# Altium project zxRevo rev2.5.PrjPcb (part 2 of 3)

## Sheet Power ATX.SchDoc
size A3; SheetNumber: 2; SheetTotal: 16
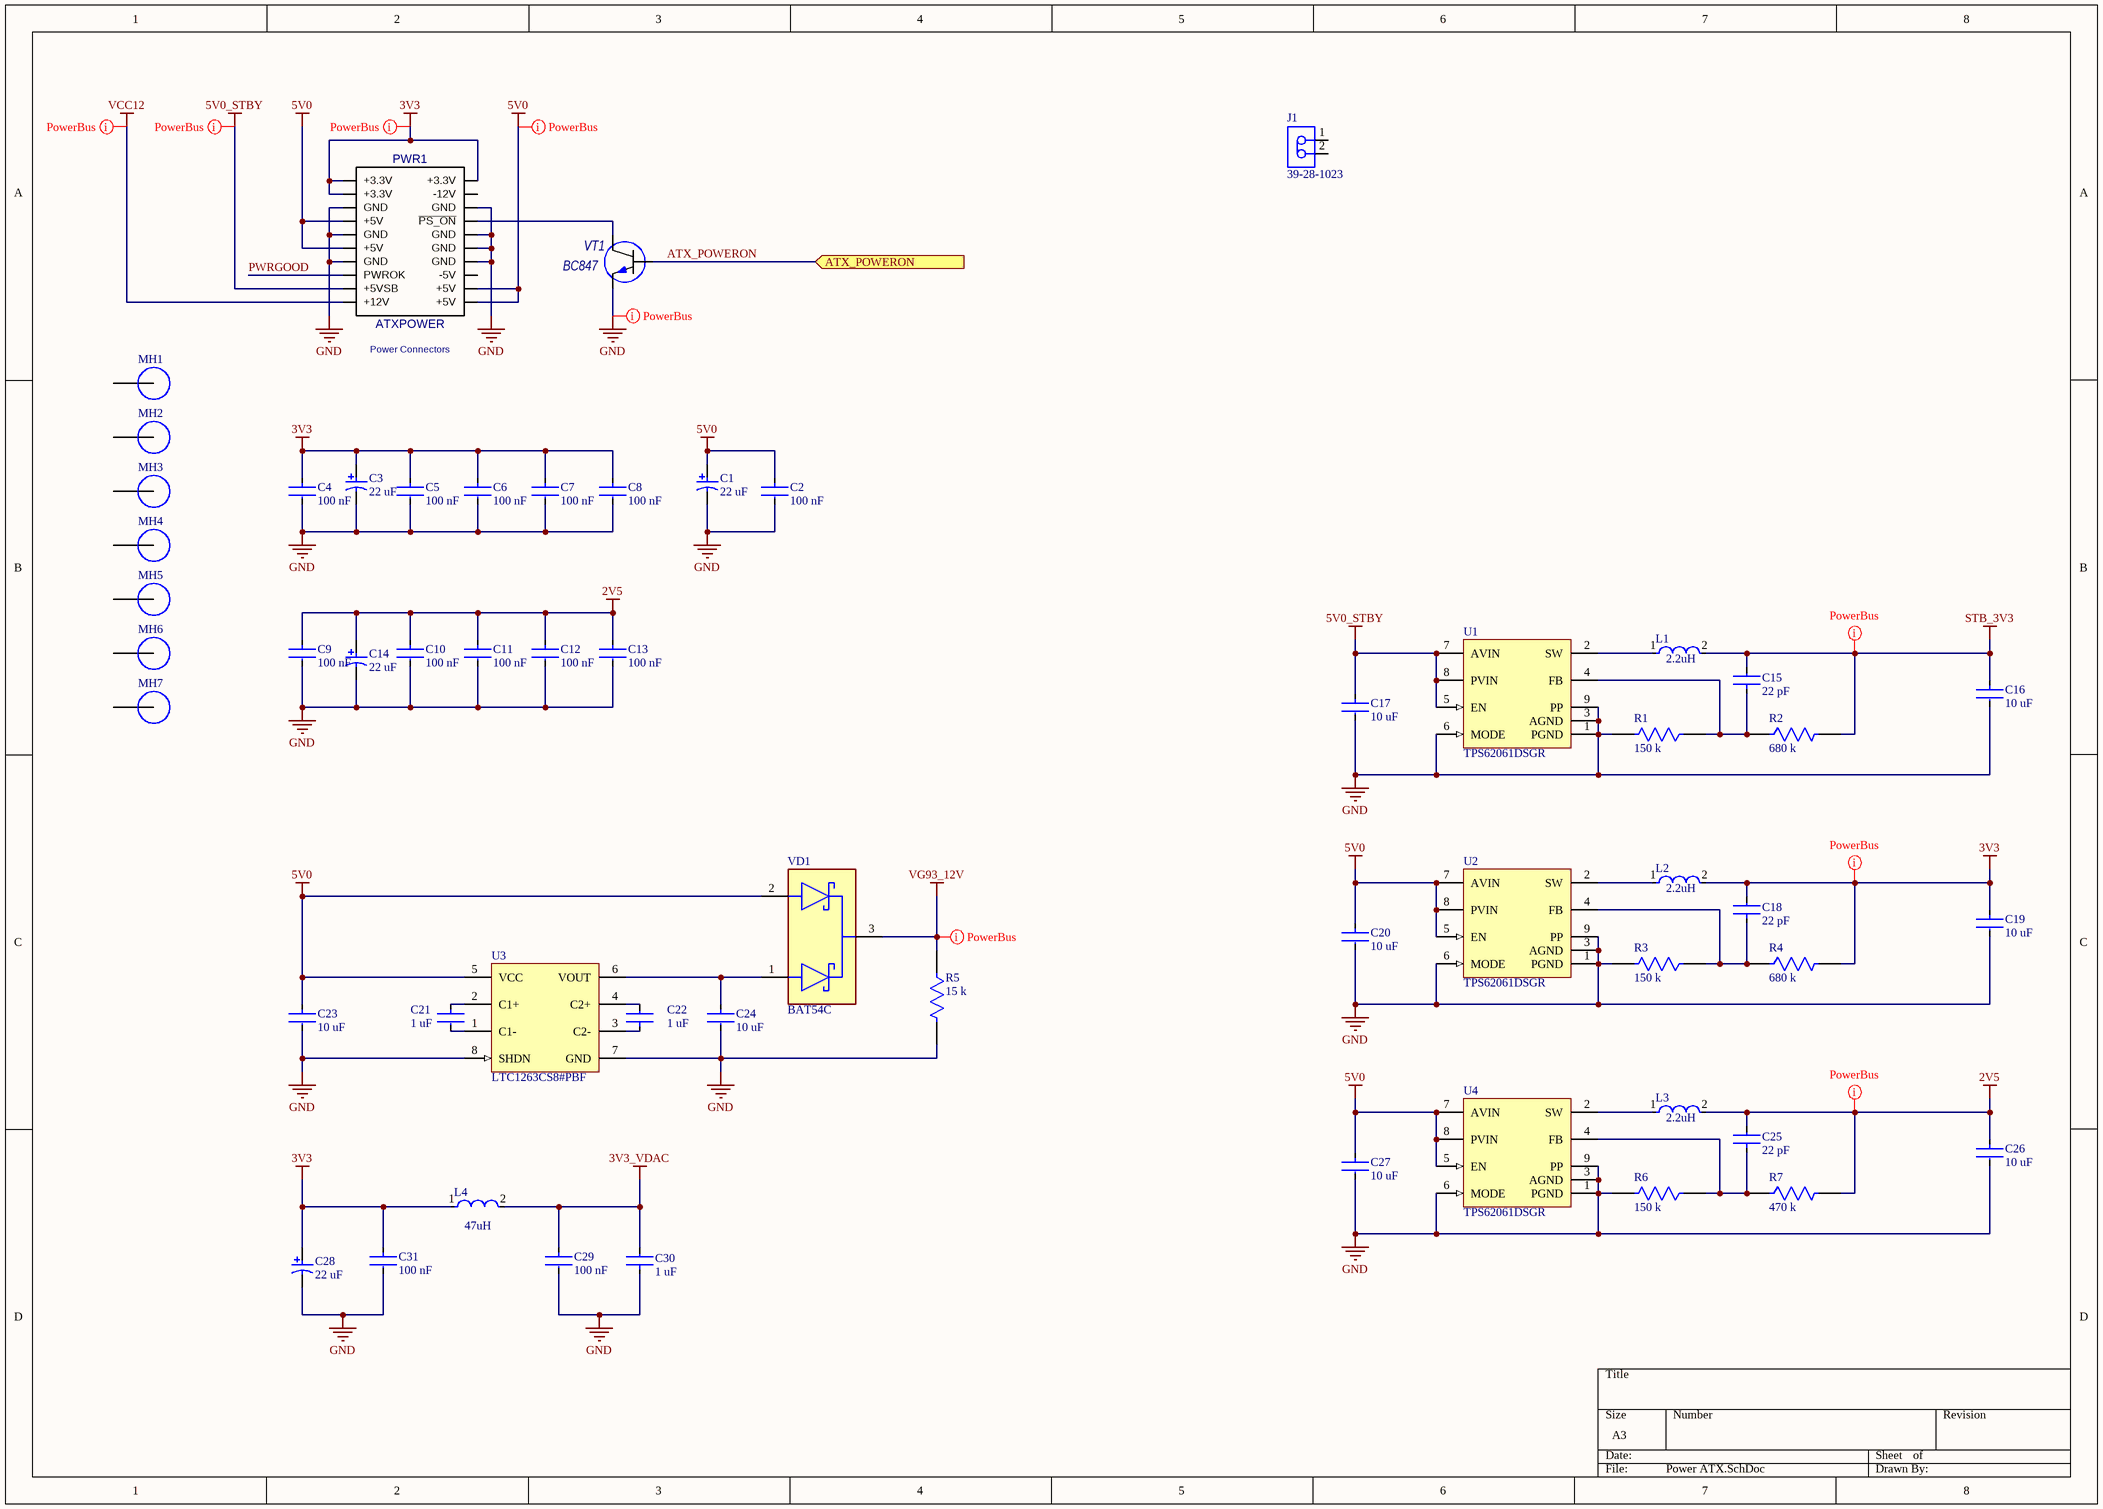
[diagram p9: Power ATX.SchDoc]

### Parts
C1  Capacitance: 22 uF  [AVX-TAJ-B-2_M]  (hidden comment: EC1210-22uF)
C2  Capacitance: 100 nF  [CC0805]  (hidden comment: CC0805-1.5pF)
C3  Capacitance: 22 uF  [AVX-TAJ-B-2_M]  (hidden comment: EC1210-22uF)
C4  Capacitance: 100 nF  [CC0805]  (hidden comment: CC0805-1.5pF)
C5  Capacitance: 100 nF  [CC0805]  (hidden comment: CC0805-1.5pF)
C6  Capacitance: 100 nF  [CC0805]  (hidden comment: CC0805-1.5pF)
C7  Capacitance: 100 nF  [CC0805]  (hidden comment: CC0805-1.5pF)
C8  Capacitance: 100 nF  [CC0805]  (hidden comment: CC0805-1.5pF)
C9  Capacitance: 100 nF  [CC0805]  (hidden comment: CC0805-1.5pF)
C10  Capacitance: 100 nF  [CC0805]  (hidden comment: CC0805-1.5pF)
C11  Capacitance: 100 nF  [CC0805]  (hidden comment: CC0805-1.5pF)
C12  Capacitance: 100 nF  [CC0805]  (hidden comment: CC0805-1.5pF)
C13  Capacitance: 100 nF  [CC0805]  (hidden comment: CC0805-1.5pF)
C14  Capacitance: 22 uF  [AVX-TAJ-B-2_M]  (hidden comment: EC1210-22uF)
C15  Capacitance: 22 pF  [CC0805]  (hidden comment: CC0805-1.5pF)
C16  Capacitance: 10 uF  [CC0805]  (hidden comment: CC0805-1.5pF)
C17  Capacitance: 10 uF  [CC0805]  (hidden comment: CC0805-1.5pF)
C18  Capacitance: 22 pF  [CC0805]  (hidden comment: CC0805-1.5pF)
C19  Capacitance: 10 uF  [CC0805]  (hidden comment: CC0805-1.5pF)
C20  Capacitance: 10 uF  [CC0805]  (hidden comment: CC0805-1.5pF)
C21  Capacitance: 1 uF  [CC0805]  (hidden comment: CC0805-1.5pF)
C22  Capacitance: 1 uF  [CC0805]  (hidden comment: CC0805-1.5pF)
C23  Capacitance: 10 uF  [CC0805]  (hidden comment: CC0805-1.5pF)
C24  Capacitance: 10 uF  [CC0805]  (hidden comment: CC0805-1.5pF)
C25  Capacitance: 22 pF  [CC0805]  (hidden comment: CC0805-1.5pF)
C26  Capacitance: 10 uF  [CC0805]  (hidden comment: CC0805-1.5pF)
C27  Capacitance: 10 uF  [CC0805]  (hidden comment: CC0805-1.5pF)
C28  Capacitance: 22 uF  [AVX-TAJ-B-2_M]  (hidden comment: EC1210-22uF)
C29  Capacitance: 100 nF  [CC0805]  (hidden comment: CC0805-1.5pF)
C30  Capacitance: 1 uF  [CC0805]  (hidden comment: CC0805-1.5pF)
C31  Capacitance: 100 nF  [CC0805]  (hidden comment: CC0805-1.5pF)
J1  39-28-1023  [MOLX-39-28-1023-2_V]
L1  Inductance: 2.2uH  [FP-NR6028-MFG]  (hidden comment: NR6028T2R2N)
L2  Inductance: 2.2uH  [FP-NR6028-MFG]  (hidden comment: NR6028T2R2N)
L3  Inductance: 2.2uH  [FP-NR6028-MFG]  (hidden comment: NR6028T2R2N)
L4  Inductance: 47uH  [FP-NR6028-MFG]  (hidden comment: NR6028T470M)
MH1  MOUNT HOLE  [MOUNT HOLE]  (value not drawn)
MH2  MOUNT HOLE  [MOUNT HOLE]  (value not drawn)
MH3  MOUNT HOLE  [MOUNT HOLE]  (value not drawn)
MH4  MOUNT HOLE  [MOUNT HOLE]  (value not drawn)
MH5  MOUNT HOLE  [MOUNT HOLE]  (value not drawn)
MH6  MOUNT HOLE  [MOUNT HOLE]  (value not drawn)
MH7  MOUNT HOLE  [MOUNT HOLE]  (value not drawn)
PWR1  ATXPOWER  [ATXPOWER]
R1  Resistance: 150 k  [CR0805]  (hidden comment: CR0805-51)
R2  Resistance: 680 k  [CR0805]  (hidden comment: CR0805-51)
R3  Resistance: 150 k  [CR0805]  (hidden comment: CR0805-51)
R4  Resistance: 680 k  [CR0805]  (hidden comment: CR0805-51)
R5  Resistance: 15 k  [CR0805]  (hidden comment: CR0805-51)
R6  Resistance: 150 k  [CR0805]  (hidden comment: CR0805-51)
R7  Resistance: 470 k  [CR0805]  (hidden comment: CR0805-51)
U1  TPS62061DSGR  [DSG0008A_V]
U2  TPS62061DSGR  [DSG0008A_V]
U3  LTC1263CS8#PBF  [LT-S8-8_N]
U4  TPS62061DSGR  [DSG0008A_V]
VD1  BAT54C  [SOT-23]
VT1  BC847  [SOT-23]

### Ports
ATX_POWERON (in)

### Nets
2V5: C9.1 C10.1 C11.1 C12.1 C13.1 C14.1 C25.2 C26.1 L3.2 R7.2
3V3: C3.1 C4.1 C5.1 C6.1 C7.1 C8.1 C18.2 C19.1 C28.1 C31.1 L2.2 L4.1 PWR1.1(+3.3V) PWR1.2(+3.3V) PWR1.11(+3.3V) R4.2
3V3_VDAC: C29.1 C30.2 L4.2
5V0: C1.1 C2.1 C20.1 C23.1 C27.1 PWR1.4(+5V) PWR1.6(+5V) PWR1.19(+5V) PWR1.20(+5V) U2.5(EN) U2.7(AVIN) U2.8(PVIN) U3.5(VCC) U4.5(EN) U4.7(AVIN) U4.8(PVIN) VD1.2(2_ANODE)
5V0_STBY: C17.1 PWR1.9(+5VSB) U1.5(EN) U1.7(AVIN) U1.8(PVIN)
GND: C1.2 C2.2 C3.2 C4.2 C5.2 C6.2 C7.2 C8.2 C9.2 C10.2 C11.2 C12.2 C13.2 C14.2 C16.2 C17.2 C19.2 C20.2 C23.2 C24.2 C26.2 C27.2 C28.2 C29.2 C30.1 C31.2 PWR1.3(GND) PWR1.5(GND) PWR1.7(GND) PWR1.13(GND) PWR1.15(GND) PWR1.16(GND) PWR1.17(GND) R1.2 R3.2 R5.2 R6.2 U1.1(PGND) U1.3(AGND) U1.6(MODE) U1.9(PP) U2.1(PGND) U2.3(AGND) U2.6(MODE) U2.9(PP) U3.7(GND) U3.8(SHDN) U4.1(PGND) U4.3(AGND) U4.6(MODE) U4.9(PP) VT1.2(emitter)
STB_3V3: C15.2 C16.1 L1.2 R2.2
VCC12: PWR1.10(+12V)
VG93_12V: R5.1 VD1.3(COMMON_CATHODE)
ATX_POWERON: VT1.1(base) ; port ATX_POWERON
PWRGOOD: PWR1.8(PWROK)  [project net PWRGOOD_2]
NetC15_1: C15.1 R1.1 R2.1 U1.4(FB)
NetC18_1: C18.1 R3.1 R4.1 U2.4(FB)
NetC21_1: C21.1 U3.2(C1+)
NetC21_2: C21.2 U3.1(C1-)
NetC22_1: C22.1 U3.3(C2-)
NetC22_2: C22.2 U3.4(C2+)
NetC24_1: C24.1 U3.6(VOUT) VD1.1(1_ANODE)
NetC25_1: C25.1 R6.1 R7.1 U4.4(FB)
NetL1_1: L1.1 U1.2(SW)
NetL2_1: L2.1 U2.2(SW)
NetL3_1: L3.1 U4.2(SW)
NetPWR1_14: PWR1.14(~{PS_ON}) VT1.3(collector)

Not connected (* = marked no-connect by the designer): J1 1 2; MH1 0(55); MH2 0(55); MH3 0(55); MH4 0(55); MH5 0(55); MH6 0(55); MH7 0(55); PWR1 12(-12V) 18(-5V)

### Layout directives
net class PowerBus: 2V5, 3V3, 5V0, 5V0_STBY, GND, STB_3V3, VCC12, VG93_12V

### Notes on the sheet
- (near PWR1) Power Connectors

### Library data of the parts
C1 C3 C14 C28 = EC1210-22uF: Standard Tantalum, 22 uF, +/- 10%, 16 V, -55 to 125 degC, 2-Pin SMD (1210), RoHS, Tape and Reel; Manufacturer: Kyocera AVX; Manufacturer Part Number: TAJB226K016RNJ; value: 22uF; Number of Pins: 2; Termination: SMD/SMT; Case/Package: 1210; Category: Cap
C2 C4-C13 C15-C20 C23-C27 C29 C31 = CC0805: as C33 on sheet TOP; value: 1.5pF; Category: Cap; Case/Package: 0805
C21 C22 C30 = CC0805: CL21 Series 0805 1.5pF 50V ±0.25pF Tolerance C0G Multilayer Ceramic Chip Capacitor; Manufacturer: Samsung; Manufacturer Part Number: CL21C1R5CBANNNC; Case/Package: 0805; value: 1.5pF; Category: Cap
J1 = CMP-2000-05244-1: Female Header, Pitch 4.2 mm, 1 x 2 Position, Height 12.8 mm, Tail Length 3.5 mm, -40 to 105 degC, RoHS; Manufacturer: Molex; No. of Poles: 2; Working Voltage: 250V; No. of Rows: 1; Current Rating: 13A; Contact Termination: Solder; No. of Contacts: 4; Connector Body Material: –; Voltage Rating V AC: 600V; Mounting Orientation: Straight; Pitch Spacing: 4.2mm; Connector Mounting: PCB; Connector Type: RectangularPower; Manufacturer URL: http://www.molex.com/; Contact Plating: Tin; Gender: Header; Lead Spacing: 4.2mm; Colour: Clear; Series: Mini-FitJr; No. of Ways: 2; MSL: –; Connector Insert Type: Header; Flammability Rating: UL94V-2; Datasheet URL: https://datasheet.ciiva.com/11746/0900766b80460d9e-11746456.pdf; Termination Method: Solder; Mounting Type: PCBoard; Contact Material: Brass; Datasheet Version: Rev. F, 05/2004; SVHC: –; Connector Mounting Orientation: PCB; Contact Gender: –
L1-L3 = CMP-14484-000415-1: SMD Power Inductors 2.2uH ±30% 3.7A 26mΩ; Core Material: Ferrite; Test Frequency: 100kHz; DC Resistance (DCR): 26mR; Saturation Current: 4.2A; Self Resonant Frequency: 68MHz; Shielding: Shielded; Width: 0.236inch; Package Quantity: 2000; Case/Package: 2424; Length: 0.236inch; Height: 2.8mm; Height - Seated (Max): 0.11inch; RMS Current (Irms): 3.7A; Current Rating: 3.7A; Termination: SMD/SMT; Tolerance: 30%; Inductance Tolerance: 30%; Depth: 6.2mm; Halogen Free: Halogen Free; Mount: Surface Mount; Series: NR; Max DC Current: 3.7A; Number of Pins: 2; Min Operating Temperature: -25°C; Max Operating Temperature: 120°C; Packaging: Tape and Reel; Radiation Hardening: No; RoHS Compliant: Yes; Resistor Type: Wirewound
L4 = CMP-14484-001222-1: as L9 on sheet SDCARD; Termination: SMD/SMT; Package Quantity: 2000; RoHS Compliant: Yes; Halogen Free: Halogen Free; Length: 0.236inch; Series: NR; Tolerance: 20%; Width: 0.236inch; Height - Seated (Max): 0.11inch; Number of Pins: 2; Mount: Surface Mount; Min Operating Temperature: -25°C; RMS Current (Irms): 920mA; Packaging: Tape and Reel; Resistor Type: Wirewound; Case/Package: 2424; Inductance Tolerance: 20%; Max Operating Temperature: 120°C; Max DC Current: 920mA; Height: 2.8mm
PWR1 = ATXPOWER: Analogs: MF-20MA;N42GP-20; Value: ATXPOWER; Case/Package: Mini-Fit 20 PIN 5.2; Category: Connector
R1-R7 = CR0805: 51Ω ±0.5% 0.1W 1/10W Chip Resistor 0805 (2012 Metric) Thin Film; Manufacturer Part Number: RR1220Q-510-D; Manufacturer: Susumu; Category: Res; value: 51Ω; Case/Package: 0805; Number of Terminations: 2; Termination: SMD/SMT; Number of Pins: 2
U1 U2 U4 = CMP-0323-00325-3: Buck Step Down Regulator with 2.7 to 6 V Input and 1.8 V Output, -40 to 85 degC, 8-Pin WSON (DSG), Green (RoHS & no Sb/Br); Manufacturer: Texas Instruments; SubFamily: Step-Down Regulator; Vin(Max)(V): 6; Preset Vout(V): 1.8; Synchronous Rectification: TRUE; Iout(Max)(A): 1.6; Switch Current Limit(Typ)(A): 2.25; Iq(Typ)(mA): 0.018; Regulated Outputs(#): 1; Duty Cycle(Max)(%): 100; Rating: Catalog; Vin(Min)(V): 2.7; ComponentLink2Description: Package Specification; PartNumber: TPS62061DSGR; ComponentLink2URL: http://www.ti.com/litv/pdf/mpds308a; ComponentLink1Description: Datasheet; PackageDescription: 8-Pin Plastic Small Outline No-Lead, 2 x 2 x 0.8 mm Body, 0.5 mm Pitch, Exposed Pad; Code_JEDEC: MO-229; Mounting Technology: Surface Mount; Vout(Min)(V): 1.8; DatasheetVersion: SLVSA95A; ComponentLink3Description: URL Link1; ComponentLink1URL: http://www.ti.com/general/docs/lit/getliterature.tsp?genericPartNumber=TPS62061&fileType=pdf; PackageReference: DSG0008A; ComponentLink3URL: Samples URL:http://www.ti.com/product/tps62061#samples; PackageVersion: revB, Oct-2010; Topology: Buck; Vout(Max)(V): 1.8; Eco-Plan: Green (RoHS & no Sb/Br)
U3 = CMP-0475-00531-1: 60 mA Flash Memory Programming Supply, 4.75 to 5.5 V Vin, 12 V Vout, 8-pin SOIC (S8-8), 0 to 70 degC, Pb-Free; Manufacturer: Linear Technology; Isupply(mA): 0.3; Vin Min(V): 4.75; Vin Max(V): 5.5; Max Iout(mA): 60; Ishutdown(uA): 0.5; Voutput: 12V; Frequency(kHz): 300; ComponentLink3Description: Package Specification; ComponentLink1Description: Manufacturer URL; ComponentLink2URL: http://cds.linear.com/docs/en/datasheet/1263f.pdf; ComponentLink3URL: http://cds.linear.com/docs/en/packaging/05081610_G_SO8.pdf; PartNumber: LTC1263CS8#PBF; ComponentLink2Description: Datasheet; ComponentLink1URL: http://www.linear.com/; PackageVersion: Rev. G, 03/2012; RoHS: TRUE; PackageReference: S8-8; Mounting Technology: Surface Mount; PackageDescription: 8-Pin Plastic Small Outline (Narrow .150 Inch), Body 4.9 x 3.9 mm, Pitch 1.27 mm
VD1 = BAT54C: DIODE ARRAY SCHOTTKY 30V SOT23-3; Manufacturer: ON Semiconductor / Fairchild; Capacitance: 10pF; Category: Diode; Manufacturer Part Number: BAT54C; Value: BAT54C; Case/Package: SOT-23
VT1 = BC847: Value: BC847; Case/Package: SOT-23; Category: Transistor

## Sheet USB.SchDoc
size A4; SheetNumber: 7; SheetTotal: 15
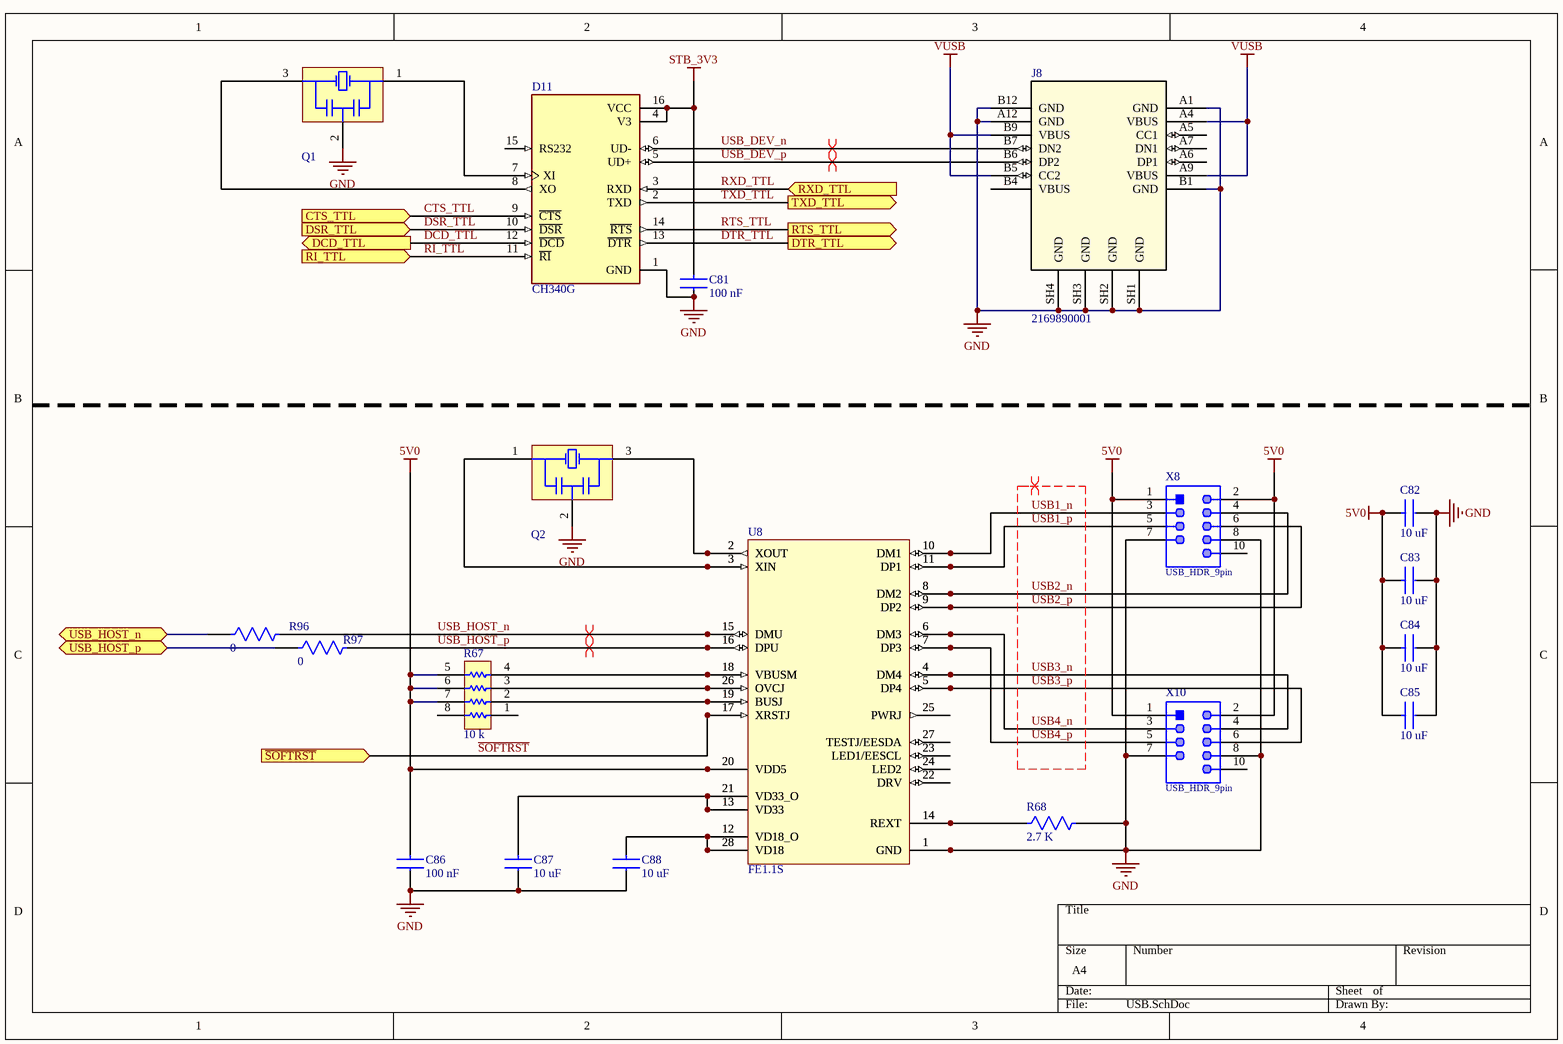
[diagram p10: USB.SchDoc]

### Parts
C81  Capacitance: 100 nF  [CC0805]  (hidden comment: CC0805-1.5pF)
C82  Capacitance: 10 uF  [CC0805]  (hidden comment: CC0805-1.5pF)
C83  Capacitance: 10 uF  [CC0805]  (hidden comment: CC0805-1.5pF)
C84  Capacitance: 10 uF  [CC0805]  (hidden comment: CC0805-1.5pF)
C85  Capacitance: 10 uF  [CC0805]  (hidden comment: CC0805-1.5pF)
C86  Capacitance: 100 nF  [CC0805]  (hidden comment: CC0805-1.5pF)
C87  Capacitance: 10 uF  [CC0805]  (hidden comment: CC0805-1.5pF)
C88  Capacitance: 10 uF  [CC0805]  (hidden comment: CC0805-1.5pF)
D11  CH340G  [SO16]
J8  2169890001  [216989-0001_MOL]
Q1  QTAL-12MHz  [MURA-CSTCE_G_V]  (value not drawn)
Q2  QTAL-12MHz  [MURA-CSTCE_G_V]  (value not drawn)
R67  Resistance: 10 k  [BOUR-CAY16-J4_V]  (hidden comment: CAY16-103J4LF)
R68  Resistance: 2.7 K  [CR0805]  (hidden comment: CR0805-51)
R96  Resistance: 0  [CR0805]  (hidden comment: CR0805-51)
R97  Resistance: 0  [CR0805]  (hidden comment: CR0805-51)
U8  FE1.1S  [TSOP64P600X160-28L]
X8  USB_HDR_9pin  [USB HDR 9 pin]
X10  USB_HDR_9pin  [USB HDR 9 pin]

### Ports
CTS_TTL (in), DCD_TTL (out), DSR_TTL (in), DTR_TTL (out), RI_TTL (in), RTS_TTL (out), RXD_TTL (in), TXD_TTL (out), USB_HOST_n (bidir), USB_HOST_p (bidir), ~{SOFTRST} (in)

### Nets
5V0: C82.1 C83.1 C84.1 C85.1 C86.1 R67.5 R67.6 R67.7 U8.20(VDD5) X8.1 X8.2 X10.1 X10.2
GND: C81.2 C82.2 C83.2 C84.2 C85.2 C86.2 C87.2 C88.2 D11.1(GND) J8.A1(GND) J8.A12(GND) J8.B1(GND) J8.B12(GND) J8.SH1(GND) J8.SH2(GND) J8.SH3(GND) J8.SH4(GND) Q1.2(GND) Q2.2(GND) R68.2 U8.1(GND) X8.7 X8.8 X10.7 X10.8
STB_3V3: C81.1 D11.4(V3) D11.16(VCC)
VUSB: J8.A4(VBUS) J8.A9(VBUS) J8.B5(CC2) J8.B9(VBUS)
CTS_TTL: D11.9(~{CTS}) ; port CTS_TTL
DCD_TTL: D11.12(~{DCD}) ; port DCD_TTL
DSR_TTL: D11.10(~{DSR}) ; port DSR_TTL
DTR_TTL: D11.13(~{DTR}) ; port DTR_TTL  [project net DTR]
RI_TTL: D11.11(~{RI}) ; port RI_TTL
RTS_TTL: D11.14(~{RTS}) ; port RTS_TTL  [project net RTS]
RXD_TTL: D11.3(RXD) ; port RXD_TTL  [project net ESP32_TXD]
~{SOFTRST}: U8.17(XRSTJ) ; port ~{SOFTRST}
TXD_TTL: D11.2(TXD) ; port TXD_TTL  [project net ESP32_RXD]
USB1_n: U8.10(DM1) X8.3  [project net USB1_n_7]
USB1_p: U8.11(DP1) X8.5  [project net USB1_p_7]
USB2_n: U8.8(DM2) X8.4  [project net USB2_n_7]
USB2_p: U8.9(DP2) X8.6  [project net USB2_p_7]
USB3_n: U8.4(DM4) X10.4  [project net USB3_n_7]
USB3_p: U8.5(DP4) X10.6  [project net USB3_p_7]
USB4_n: U8.6(DM3) X10.3  [project net USB4_n_7]
USB4_p: U8.7(DP3) X10.5  [project net USB4_p_7]
USB_DEV_n: D11.6(UD-) J8.B7(DN2)  [project net USB_DEV_n_7]
USB_DEV_p: D11.5(UD+) J8.B6(DP2)  [project net USB_DEV_p_7]
USB_HOST_n: R96.2 U8.15(DMU)  [project net USB_HOST_n_7]
USB_HOST_p: R97.2 U8.16(DPU)  [project net USB_HOST_p_7]
USB_n: R96.1 ; port USB_HOST_n
USB_p: R97.1 ; port USB_HOST_p
NetC87_1: C87.1 U8.13(VD33) U8.21(VD33_O)
NetC88_1: C88.1 U8.12(VD18_O) U8.28(VD18)
NetD11_7: D11.7(XI) Q1.1(X1)
NetD11_8: D11.8(XO) Q1.3(X2)
NetQ2_1: Q2.1(X1) U8.3(XIN)
NetQ2_3: Q2.3(X2) U8.2(XOUT)
NetR67_2: R67.2 U8.19(BUSJ)
NetR67_3: R67.3 U8.26(OVCJ)
NetR67_4: R67.4 U8.18(VBUSM)
NetR68_1: R68.1 U8.14(REXT)

Not connected (* = marked no-connect by the designer): D11 15(RS232); J8 A5(CC1) A6(DP1) A7(DN1) B4(VBUS); R67 1 8; U8 22(DRV) 23(LED1/EESCL) 24(LED2) 25(PWRJ) 27(TESTJ/EESDA); X8 10; X10 10

### Layout directives
differential pair: USB1_n, USB1_p, USB2_n, USB2_p, USB3_n, USB3_p, USB4_n, USB4_p, USB_DEV_n_7, USB_DEV_p_7, USB_HOST_n_7, USB_HOST_p_7

### Library data of the parts
C81-C88 = CC0805: CL21 Series 0805 1.5pF 50V ±0.25pF Tolerance C0G Multilayer Ceramic Chip Capacitor; Manufacturer Part Number: CL21C1R5CBANNNC; Manufacturer: Samsung; Category: Cap; value: 1.5pF; Case/Package: 0805
D11 = CH340G: USB Interface Integrated Circuit; Value: CH340G; Case/Package: SOIC-16; Category: IC
J8 = 2169890001: No Description Available; Mfr_Name: Molex Connector Corporation; Copyright: Copyright (C) 2022 Ultra Librarian. All rights reserved.; Manufacturer_Part_Number: 2169890001; RefDes: RefDes; Type: DEV
Q1 Q2 = QTAL-12MHz: Ceramic Resonator, 12 MHz, +/- 0.5%, -40 to 125 degC, 3-Pin SMD, RoHS, Tape and Reel; Manufacturer: Murata; Manufacturer Part Number: CSTCE12M0G55Z-R0; Capacitance: 33pF; value: CSTCE12M0G55Z-R0; Category: CrystalsandOscillators
R67 = CMP-1747-00005-1: Chip Resistor Array, 10 KOhm, +/- 5%, 62.5 mW, -55 to 125 degC, 8-Pin SMD, RoHS, Tape and Reel; Power Rating: 100 mW; Case\Package: 0603; Voltage Rating: 75 V; Tolerance: 1%; Packaging: Tape and Reel; Min Operating Temperature: -55 degC; Pins: 2; Radiation Hardening: No; DatasheetVersion: Jan-15; Length: 0.063 inch; RoHSCompliant: true; Mount: Surface Mount; ComponentLink1Description: Manufacturer URL; ComponentLink1URL: http://www.bourns.com/; Weight: 7.1E-05 oz; ComponentLink2URL: http://www.bourns.com/docs/Product-Datasheets/CATCAY.pdf; PackageReference: CAY16-J4; Width: 0.031 inch; Case Code (Imperial): 0603; Case Code (Metric): 1608; REACH SVHC: Yes; Max Operating Temperature: 155 degC; ComponentLink2Description: Datasheet; Height: 0.022 inch; PackageDescription: 8-Pin Surface Mount Device, Body 1.6 x 3.2 mm, Pitch 0.8 mm
R68 = CR0805: 51Ω ±0.5% 0.1W 1/10W Chip Resistor 0805 (2012 Metric) Thin Film; Manufacturer Part Number: RR1220Q-510-D; Manufacturer: Susumu; Category: Res; value: 51Ω; Case/Package: 0805; Number of Terminations: 2; Termination: SMD/SMT; Number of Pins: 2
R96 R97 = CR0805: 51Ω ±0.5% 0.1W 1/10W Chip Resistor 0805 (2012 Metric) Thin Film; Manufacturer: Susumu; Manufacturer Part Number: RR1220Q-510-D; Case/Package: 0805; Number of Pins: 2; Termination: SMD/SMT; value: 51Ω; Category: Res; Number of Terminations: 2
U8 = FE1.1S: USB 2.0 HIGH SPEED 4-PORT HUB CONTROLLER; Manufacturer: Terminus Technology Inc; value: FE1.1S; Case/Package: SSOP-28; Category: IC
X8 X10 = USB_HDR_9pin: THT Vertical Pin Header WR-PHD, Pitch 2.54 mm, Dual Row, 10 pins; Manufacturer: Wurth Elektronik; Part Number: 61301021121; Manufacturer: Wurth Electronics; Working Voltage: 250VAC; Pitch: 2.54mm; Contact Resistance: 20mOhm; Gender: Male; Rated Current: 3A; Withstanding Voltage: 500VAC; Pin Number: 10; Operating Temperature: -40to105degC; Mounting Technology: THT; Publisher: WurthElektronik; Manufacturer URL: http://www.we-online.de; Row Number: Dual; Packaging: Bag; Orientation: Vertical; Package Reference: 61301021121; Datasheet URL: https://katalog.we-online.de/em/datasheet/6130xx21121.pdf; Manufacturer Part Number: 61301021121

## Sheet ESP32.SchDoc
size A3; SheetNumber: 12; SheetTotal: 16
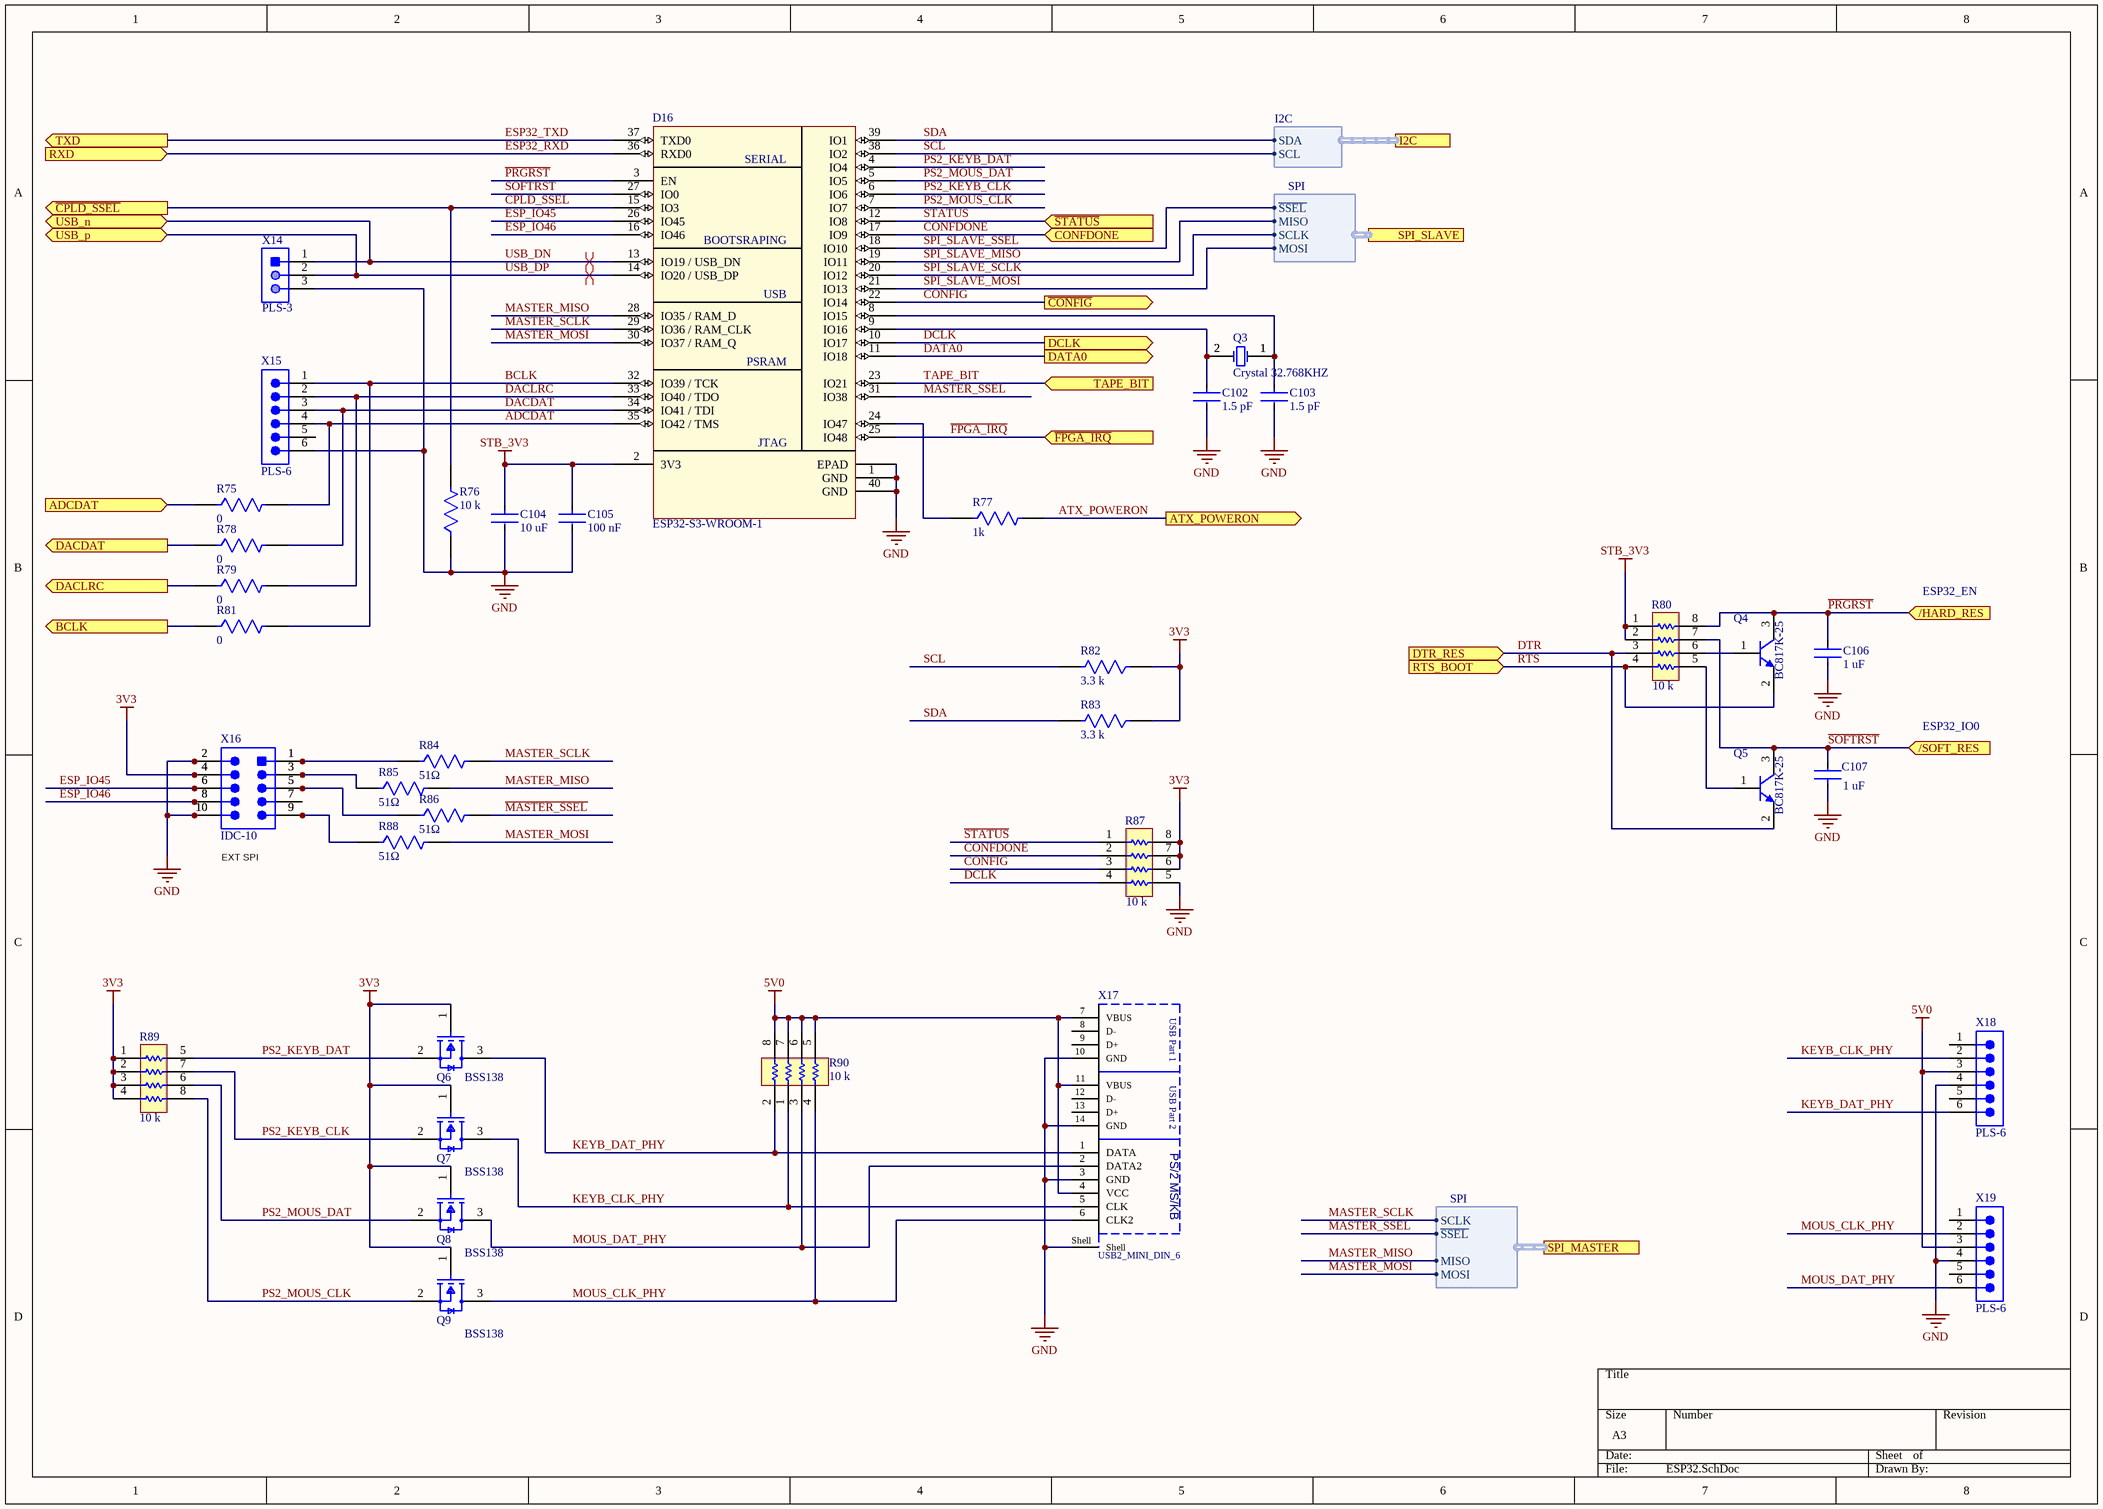
[diagram p11: ESP32.SchDoc]

### Parts
C102  Capacitance: 1.5 pF  [CC0805]  (hidden comment: CC0805-1.5pF)
C103  Capacitance: 1.5 pF  [CC0805]  (hidden comment: CC0805-1.5pF)
C104  Capacitance: 10 uF  [CC0805]  (hidden comment: CC0805-1.5pF)
C105  Capacitance: 100 nF  [CC0805]  (hidden comment: CC0805-1.5pF)
C106  Capacitance: 1 uF  [CC0805]  (hidden comment: CC0805-1.5pF)
C107  Capacitance: 1 uF  [CC0805]  (hidden comment: CC0805-1.5pF)
D16  ESP32-S3-WROOM-1  [ESP32S3WROOM1]
Q3  Crystal 32.768KHZ  [ABRA-AB15T-2_V]
Q4  BC817K-25  [SOT-23]
Q5  BC817K-25  [SOT-23]
Q6  BSS138  [SOT-23]
Q7  BSS138  [SOT-23]
Q8  BSS138  [SOT-23]
Q9  BSS138  [SOT-23]
R75  Resistance: 0  [CR0805]  (hidden comment: CR0805-51)
R76  Resistance: 10 k  [CR0805]  (hidden comment: CR0805-51)
R77  Resistance: 1k  [CR0805]  (hidden comment: CR0805-51)
R78  Resistance: 0  [CR0805]  (hidden comment: CR0805-51)
R79  Resistance: 0  [CR0805]  (hidden comment: CR0805-51)
R80  Resistance: 10 k  [BOUR-CAY16-J4_V]  (hidden comment: CAY16-103J4LF)
R81  Resistance: 0  [CR0805]  (hidden comment: CR0805-51)
R82  Resistance: 3.3 k  [CR0805]  (hidden comment: CR0805-51)
R83  Resistance: 3.3 k  [CR0805]  (hidden comment: CR0805-51)
R84  value 51Ω  [CR0805]  (hidden comment: CR0805-51)
R85  value 51Ω  [CR0805]  (hidden comment: CR0805-51)
R86  value 51Ω  [CR0805]  (hidden comment: CR0805-51)
R87  Resistance: 10 k  [BOUR-CAY16-J4_V]  (hidden comment: CAY16-103J4LF)
R88  value 51Ω  [CR0805]  (hidden comment: CR0805-51)
R89  Resistance: 10 k  [BOUR-CAY16-J4_V]  (hidden comment: CAY16-103J4LF)
R90  Resistance: 10 k  [BOUR-CAY16-J4_V]  (hidden comment: CAY16-103J4LF)
X14  PLS-3  [MOLX-22-28-4033_V]
X15  PLS-6  [SMTC-TSW-106-07-X-S]
X16  IDC-10  [BH-10]
X17  USB2_MINI_DIN_6  [USB2_MINI_DIN_6 (USB Only)]
X18  PLS-6  [SMTC-TSW-106-07-X-S]
X19  PLS-6  [SMTC-TSW-106-07-X-S]

### Ports
/HARD_RES (in), /SOFT_RES (in), ADCDAT (in), ATX_POWERON (out), BCLK (out), CONFDONE (in), DACDAT (out), DACLRC (out), DATA0 (out), DCLK (out), DTR_RES (in), I2C (harness I2C), RTS_BOOT (in), RXD (in), SPI_MASTER (harness SPI), SPI_SLAVE (harness SPI), TAPE_BIT (in), TXD (out), USB_n (bidir), USB_p (bidir), ~{CONFIG} (out), ~{CPLD_SSEL} (out), ~{FPGA_IRQ} (in), ~{STATUS} (in)

### Harnesses
SPI: ~{SSEL}, SCLK, MOSI, MISO
I2C: SDA, SCL

### Nets
3V3: Q6.1(G) Q7.1(G) Q8.1(G) Q9.1(G) R82.1 R83.1 R87.6 R87.7 R87.8 R89.1 R89.2 R89.3 R89.4 X16.4
5V0: R90.5 R90.6 R90.7 R90.8 X17.4(VCC) X17.7(VBUS) X17.11(VBUS) X18.3 X19.3
GND: C102.2 C103.2 C104.2 C105.2 C106.1 C107.1 D16.1(GND) D16.40(GND) D16.EPAD R76.1 R87.5 X14.3 X15.6 X16.2 X16.10 X17.3(GND) X17.10(GND) X17.14(GND) X17.Shell X18.4 X19.4
STB_3V3: C104.1 C105.1 D16.2(3V3) R80.1 R80.2
ADCDAT: R75.1 ; port ADCDAT
ADCDAT: D16.35(IO42_/_TMS) R75.2 X15.4  [project net ADCDAT_12]  [a separate net that carries the same name]
ATX_POWERON: R77.2 ; port ATX_POWERON
BCLK: R81.1 ; port BCLK
BCLK: D16.32(IO39_/_TCK) R81.2 X15.1  [project net BCLK_12]  [a separate net that carries the same name]
~{CONFIG}: D16.22(IO14) R87.3 ; port ~{CONFIG}
~{CPLD_SSEL}: D16.15(IO3) R76.2 ; port ~{CPLD_SSEL}
CONFDONE: D16.17(IO9) R87.2 ; port CONFDONE
DACDAT: D16.34(IO41_/_TDI) R78.2 X15.3  [project net DACDAT_12]
DACDAT: R78.1 ; port DACDAT  [a separate net that carries the same name]
DACLRC: R79.1 ; port DACLRC
DACLRC: D16.33(IO40_/_TDO) R79.2 X15.2  [project net DACLRC_12]  [a separate net that carries the same name]
DATA0: D16.11(IO18) ; port DATA0
DCLK: D16.10(IO17) R87.4 ; port DCLK
DTR: Q5.2(E) R80.3 ; port DTR_RES
ESP32_RXD: D16.36(RXD0) ; port RXD
ESP32_TXD: D16.37(TXD0) ; port TXD
ESP_IO45: D16.26(IO45) X16.6  [project net ESP_IO45_12]
ESP_IO46: D16.16(IO46) X16.8  [project net ESP_IO46_12]
~{FPGA_IRQ}: D16.25(IO48) ; port ~{FPGA_IRQ}  [project net ~{SPI_SLAVE_IRQ}]
KEYB_CLK_PHY: Q7.3(D) R90.1 X17.5(CLK) X18.2  [project net KEYB_CLK_PHY_12]
KEYB_DAT_PHY: Q6.3(D) R90.2 X17.1(DATA) X18.6  [project net KEYB_DAT_PHY_12]
~{MASTER_SSEL}: D16.31(IO38) R86.2 ; port SPI_MASTER.~{SSEL}  [project net ESP32_MASTER.~{SSEL}]
MASTER_MISO: D16.28(IO35_/_RAM_D) R85.2 ; port SPI_MASTER.MISO  [project net ESP32_MASTER.MISO]
MASTER_MOSI: D16.30(IO37_/_RAM_Q) R88.2 ; port SPI_MASTER.MOSI  [project net ESP32_MASTER.MOSI]
MASTER_SCLK: D16.29(IO36_/_RAM_CLK) R84.2 ; port SPI_MASTER.SCLK  [project net ESP32_MASTER.SCLK]
MOUS_CLK_PHY: Q9.3(D) R90.4 X17.6(CLK2) X19.2  [project net MOUS_CLK_PHY_12]
MOUS_DAT_PHY: Q8.3(D) R90.3 X17.2(DATA2) X19.6  [project net MOUS_DAT_PHY_12]
~{PRGRST}: C106.2 D16.3(EN) Q4.3(C) R80.8 ; port /HARD_RES  [project net /HARD_RES]
PS2_KEYB_CLK: D16.6(IO6) Q7.2(S) R89.7  [project net PS2_KEYB_CLK_12]
PS2_KEYB_DAT: D16.4(IO4) Q6.2(S) R89.5  [project net PS2_KEYB_DAT_12]
PS2_MOUS_CLK: D16.7(IO7) Q9.2(S) R89.8  [project net PS2_MOUS_CLK_12]
PS2_MOUS_DAT: D16.5(IO5) Q8.2(S) R89.6  [project net PS2_MOUS_DAT_12]
RTS: Q4.2(E) R80.4 ; port RTS_BOOT
~{SOFTRST}: C107.2 D16.27(IO0) Q5.3(C) R80.7 ; port /SOFT_RES  [project net /SOFT_RES]
~{SPI_SLAVE_SSEL}: D16.18(IO10) ; port SPI_SLAVE.~{SSEL}  [project net ESP32_SLAVE.~{SSEL}]
~{STATUS}: D16.12(IO8) R87.1 ; port ~{STATUS}
SCL: D16.38(IO2) R82.2 ; port I2C.SCL  [project net I2C.SCL]
SDA: D16.39(IO1) R83.2 ; port I2C.SDA  [project net I2C.SDA]
SPI_SLAVE_MISO: D16.19(IO11) ; port SPI_SLAVE.MISO  [project net ESP32_SLAVE.MISO]
SPI_SLAVE_MOSI: D16.21(IO13) ; port SPI_SLAVE.MOSI  [project net ESP32_SLAVE.MOSI]
SPI_SLAVE_SCLK: D16.20(IO12) ; port SPI_SLAVE.SCLK  [project net ESP32_SLAVE.SCLK]
TAPE_BIT: D16.23(IO21) ; port TAPE_BIT
USB_DN: D16.13(IO19_/_USB_DN) X14.1 ; port USB_n  [project net USB_n]
USB_DP: D16.14(IO20_/_USB_DP) X14.2 ; port USB_p  [project net USB_p]
NetC102_1: C102.1 D16.9(IO16) Q3.2(X2)
NetC103_1: C103.1 D16.8(IO15) Q3.1(X1)
NetD16_24: D16.24(IO47) R77.1
NetQ4_1: Q4.1(B) R80.6
NetQ5_1: Q5.1(B) R80.5
NetR84_1: R84.1 X16.1
NetR85_1: R85.1 X16.3
NetR86_1: R86.1 X16.5
NetR88_1: R88.1 X16.9

Not connected (* = marked no-connect by the designer): X15 5; X16 7; X17 8(D-) 9(D+) 12(D-) 13(D+); X18 1 5; X19 1 5

### Layout directives
differential pair: USB_n, USB_p

### Notes on the sheet
- ESP32_EN
- ESP32_IO0
- (near X16) EXT SPI
- (in symbol ESP32-S3-WROOM-1) SERIAL; BOOTSRAPING; USB; PSRAM; JTAG
- (in symbol USB2_MINI_DIN_6) USB Part 1; USB Part 2; PS/2 MS/KB

### Library data of the parts
C102 C103 C106 C107 = CC0805: CL21 Series 0805 1.5pF 50V ±0.25pF Tolerance C0G Multilayer Ceramic Chip Capacitor; Manufacturer: Samsung; Manufacturer Part Number: CL21C1R5CBANNNC; Case/Package: 0805; value: 1.5pF; Category: Cap
C104 C105 = CC0805: as C81-C88 on sheet USB; value: 1.5pF; Category: Cap; Case/Package: 0805
D16 = ESP32-S3-WROOM-1: 2.4 GHz Wi­Fi (802.11 b/g/n) and Bluetooth® 5 (LE) module / Built around ESP32­S3 series of SoCs, Xtensa® dual­core 32­bit LX7 microprocessor / Flash up to 16 MB, PSRAM up to 8 MB / 36 GPIOs, rich set of peripherals / Onboard PCB antenna or external antenna connector; value: ESP32-S3-WROOM-1; Case/Package: ESP32-S3; Category: IC
Q3 = Crystal 32.768KHZ: Low Frequency Cylindrical Watch Crystal, 32.768 kHz, -20 to 70 degC, 2-Pin 5 x 1.4 x 1.5 mm THD, RoHS, Bulk; PartNumber: AB15T-32.768KHZ; Manufacturer: Abracon; value: AB15T-32.768KHZ; PackageDescription: 2-Pin THD, Body 5 x 1.4 mm, Pin Spacing 0.45 mm; Manufacturer Part Number: AB15T-32.768KHZ; Category: CrystalsandOscillators
Q4 Q5 = BC817K-25: NPN Silicon AF Transistor, 45 V VCEO, 500 mA IC, SOT23, Reel, Green; Manufacturer: Infineon; PackageDescription: 3-Pin Small Outline Transistor Package, 1.3 x 2.9 mm Body, 0.95 mm Pitch; PartNumber: BC817K-25; Manufacturer Part Number: BC817K-25; value: BC817K-25; Case/Package: SOT-23; Category: Transistor
Q6-Q9 = BSS138: MOSFET N-CH 50V 220MA SOT-23; Manufacturer: ON Semiconductor / Fairchild; Number of Pins: 3; Case/Package: SOT-23; Termination: SMD/SMT; Manufacturer Part Number: BSS138; value: BSS138; Category: Transistor
R75-R79 R81 = CR0805: as R96 on sheet USB; Case/Package: 0805; Number of Pins: 2; Termination: SMD/SMT; value: 51Ω; Category: Res; Number of Terminations: 2
R80 R87 R89 R90 = CMP-1747-00005-1: as R67 on sheet USB; Packaging: Tape and Reel; Min Operating Temperature: -55 degC; Pins: 2; Radiation Hardening: No; DatasheetVersion: Jan-15; Length: 0.063 inch; RoHSCompliant: true; Mount: Surface Mount; ComponentLink1Description: Manufacturer URL; ComponentLink1URL: http://www.bourns.com/; Weight: 7.1E-05 oz; ComponentLink2URL: http://www.bourns.com/docs/Product-Datasheets/CATCAY.pdf; PackageReference: CAY16-J4; Width: 0.031 inch; Case Code (Imperial): 0603; Case Code (Metric): 1608; REACH SVHC: Yes; Max Operating Temperature: 155 degC; ComponentLink2Description: Datasheet; Height: 0.022 inch; PackageDescription: 8-Pin Surface Mount Device, Body 1.6 x 3.2 mm, Pitch 0.8 mm
R82 R83 = CR0805: as R68 on sheet USB; value: 51Ω; Category: Res; Case/Package: 0805; Number of Terminations: 2; Termination: SMD/SMT; Number of Pins: 2
R84-R86 R88 = CR0805: 51Ω ±0.5% 0.1W 1/10W Chip Resistor 0805 (2012 Metric) Thin Film; Manufacturer: Susumu; Manufacturer Part Number: RR1220Q-510-D; Resistance: 680; Category: Res; Case/Package: 0805; Number of Terminations: 2; Termination: SMD/SMT; Number of Pins: 2
X14 = PLS-3: Male Header, Pitch 2.54 mm, 1 x 3 Position, Height 8.38 mm, Tail Length 3.18 mm, RoHS, Bulk; Manufacturer: Molex; value: header 3 pin, 2.54mm; PackageDescription: Male Header, Pitch 2.54 mm, 1 x 3 Position, Height 8.38 mm, Tail Length 3.18 mm; Manufacturer Part Number: 22-28-4033; Case/Package: PLS-3; Category: Connector
X15 X18 X19 = CMP-1024-00383-1: 0.025" SQ Post Header, Through-hole, Vertical, -55 to 125 degC, 2.54 mm Pitch, 6-Pin, Male, RoHS; Manufacturer: Samtec; PartNumber: TSW-106-07-G-S; Pitch: 2.54 mm; value: 6 pin header 2.54mm; PackageDescription: .025[0.64] SQ. Post Terminal Strip Assembly; Manufacturer Part Number: TSW-106-07-G-S; Case/Package: PLS-6; Category: Connector
X16 = IDC-10: Male Header, Pitch 2.54 mm, 2 x 5 Postion, Height 9.91 mm, Tail Length 2.84 mm, -55 to 105 degC, RoHS, Bulk; PartNumber: N2510; Manufacturer: 3M; Manufacturer Part Number: N2510-6002RB; Pitch: 2.54mm; value: 10-Pin Shrouded Header, 2.54mm; Case/Package: IDC-10; Category: Connector
X17 = USB2_MINI_DIN_6: USB 2.0 Type A Receptacle WR-COM, Mini DIN 6 Stacked Horizontal, THT; Part Number: 61400826021; Manufacturer: Wurth Electronics; Contact Resistance: 20mOhm; Rated Current: 1.5A; Working Voltage: 30VAC; Connector Type: USB2.0TypeA; Packaging: Tray; Package Reference: 61400826021; Mounting Technology: THT; Datasheet URL: https://katalog.we-online.de/em/datasheet/61400826021.pdf; Operating Temperature: -40to105degC; Gender: Receptacle; Orientation: StackedHorizontal; Publisher: WurthElektronik; Manufacturer URL: http://www.we-online.de; Manufacturer Part Number: 61400826021

## Sheet AY Amp.SchDoc
size A3; SheetNumber: 3; SheetTotal: 15
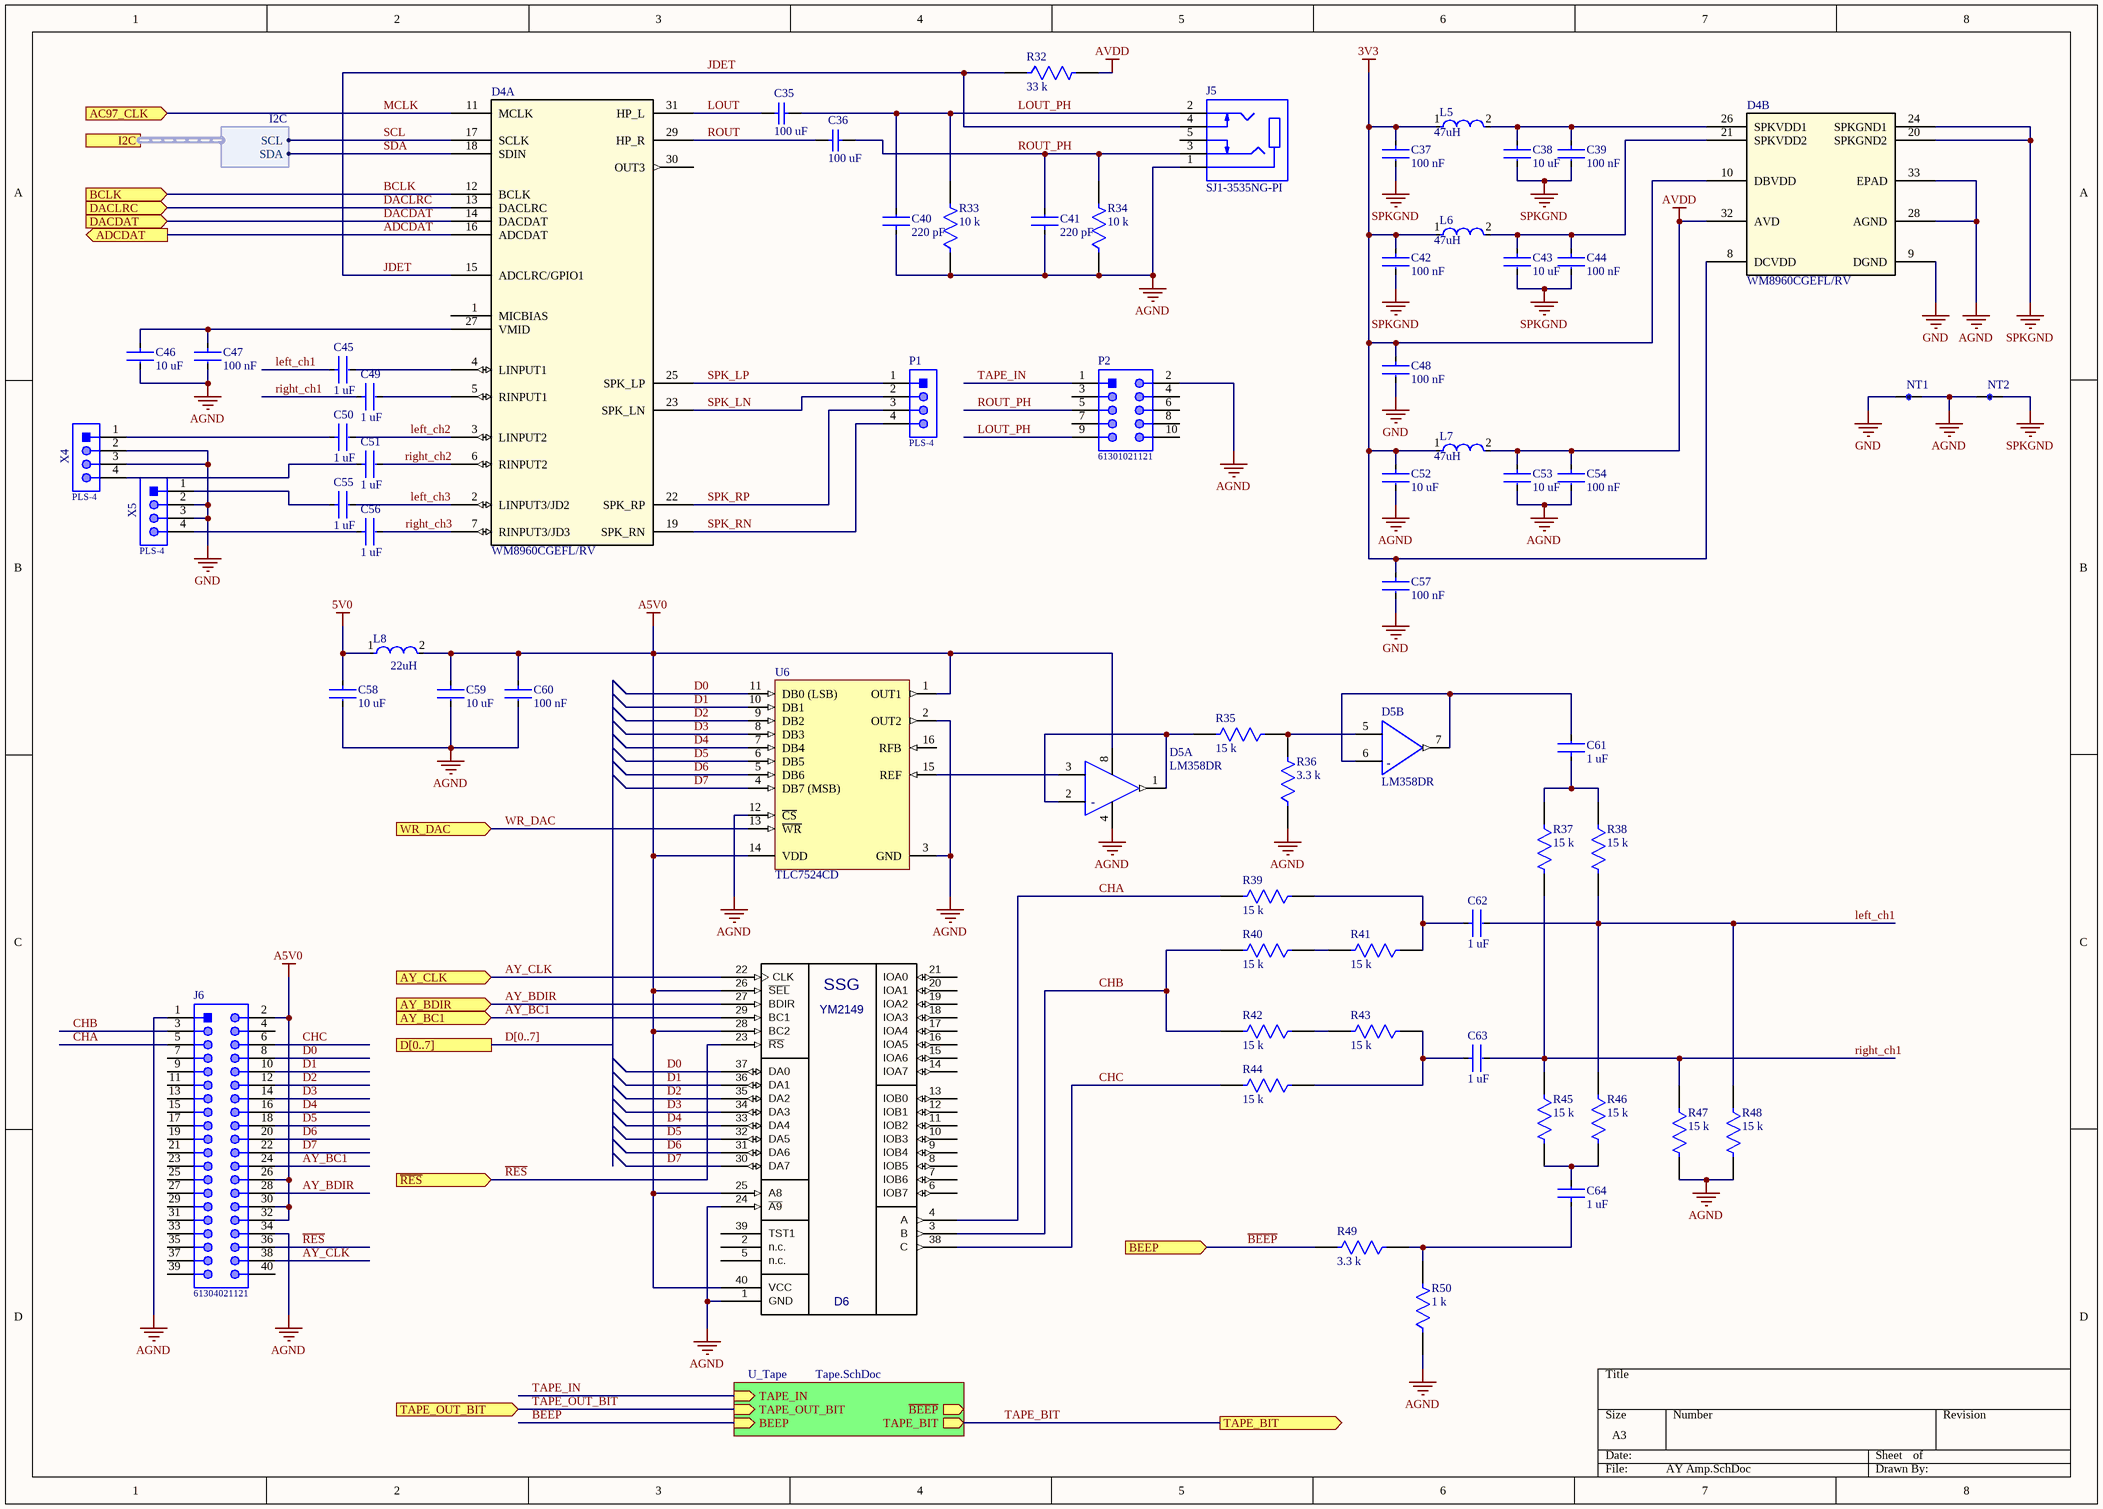
[diagram p12: AY Amp.SchDoc]

### Parts
C35  Capacitance: 100 uF  [CAPC3216X190X55ML30T25]  (hidden comment: CC1206-100uF)
C36  Capacitance: 100 uF  [CAPC3216X190X55ML30T25]  (hidden comment: CC1206-100uF)
C37  Capacitance: 100 nF  [CC0805]  (hidden comment: CC0805-1.5pF)
C38  Capacitance: 10 uF  [CC0805]  (hidden comment: CC0805-1.5pF)
C39  Capacitance: 100 nF  [CC0805]  (hidden comment: CC0805-1.5pF)
C40  Capacitance: 220 pF  [CC0805]  (hidden comment: CC0805-1.5pF)
C41  Capacitance: 220 pF  [CC0805]  (hidden comment: CC0805-1.5pF)
C42  Capacitance: 100 nF  [CC0805]  (hidden comment: CC0805-1.5pF)
C43  Capacitance: 10 uF  [CC0805]  (hidden comment: CC0805-1.5pF)
C44  Capacitance: 100 nF  [CC0805]  (hidden comment: CC0805-1.5pF)
C45  Capacitance: 1 uF  [CC0805]  (hidden comment: CC0805-1.5pF)
C46  Capacitance: 10 uF  [CC0805]  (hidden comment: CC0805-1.5pF)
C47  Capacitance: 100 nF  [CC0805]  (hidden comment: CC0805-1.5pF)
C48  Capacitance: 100 nF  [CC0805]  (hidden comment: CC0805-1.5pF)
C49  Capacitance: 1 uF  [CC0805]  (hidden comment: CC0805-1.5pF)
C50  Capacitance: 1 uF  [CC0805]  (hidden comment: CC0805-1.5pF)
C51  Capacitance: 1 uF  [CC0805]  (hidden comment: CC0805-1.5pF)
C52  Capacitance: 10 uF  [CC0805]  (hidden comment: CC0805-1.5pF)
C53  Capacitance: 10 uF  [CC0805]  (hidden comment: CC0805-1.5pF)
C54  Capacitance: 100 nF  [CC0805]  (hidden comment: CC0805-1.5pF)
C55  Capacitance: 1 uF  [CC0805]  (hidden comment: CC0805-1.5pF)
C56  Capacitance: 1 uF  [CC0805]  (hidden comment: CC0805-1.5pF)
C57  Capacitance: 100 nF  [CC0805]  (hidden comment: CC0805-1.5pF)
C58  Capacitance: 10 uF  [CC0805]  (hidden comment: CC0805-1.5pF)
C59  Capacitance: 10 uF  [CC0805]  (hidden comment: CC0805-1.5pF)
C60  Capacitance: 100 nF  [CC0805]  (hidden comment: CC0805-1.5pF)
C61  Capacitance: 1 uF  [CC0805]  (hidden comment: CC0805-1.5pF)
C62  Capacitance: 1 uF  [CC0805]  (hidden comment: CC0805-1.5pF)
C63  Capacitance: 1 uF  [CC0805]  (hidden comment: CC0805-1.5pF)
C64  Capacitance: 1 uF  [CC0805]  (hidden comment: CC0805-1.5pF)
D4  WM8960CGEFL/RV  [QFN50P500X500X90_HS-33M]  (parts A,B of 2)
D5  LM358DR  [FP-D0008A-MFG]  (parts A,B of 2)
D6  YM2149  [DIP40]
J5  SJ1-3535NG-PI  [CUI_SJ1-3535NG-PI]
J6  61304021121  [61304021121]
L5  Inductance: 47uH  [FP-NR6028-MFG]  (hidden comment: NR6028T470M)
L6  Inductance: 47uH  [FP-NR6028-MFG]  (hidden comment: NR6028T470M)
L7  Inductance: 47uH  [FP-NR6028-MFG]  (hidden comment: NR6028T470M)
L8  Inductance: 22uH  [FP-LQH43CN_03-MFG]  (hidden comment: LQH43CN220K03L)
NT1  net_tie  [NET_TIE]  (value not drawn)  (net tie, no BOM)
NT2  net_tie  [NET_TIE]  (value not drawn)  (net tie, no BOM)
P1  PLS-4  [61300411121]
P2  61301021121  [61301021121]
R32  Resistance: 33 k  [CR0805]  (hidden comment: CR0805-51)
R33  Resistance: 10 k  [CR0805]  (hidden comment: CR0805-51)
R34  Resistance: 10 k  [CR0805]  (hidden comment: CR0805-51)
R35  Resistance: 15 k  [CR0805]  (hidden comment: CR0805-51)
R36  Resistance: 3.3 k  [CR0805]  (hidden comment: CR0805-51)
R37  Resistance: 15 k  [CR0805]  (hidden comment: CR0805-51)
R38  Resistance: 15 k  [CR0805]  (hidden comment: CR0805-51)
R39  Resistance: 15 k  [CR0805]  (hidden comment: CR0805-51)
R40  Resistance: 15 k  [CR0805]  (hidden comment: CR0805-51)
R41  Resistance: 15 k  [CR0805]  (hidden comment: CR0805-51)
R42  Resistance: 15 k  [CR0805]  (hidden comment: CR0805-51)
R43  Resistance: 15 k  [CR0805]  (hidden comment: CR0805-51)
R44  Resistance: 15 k  [CR0805]  (hidden comment: CR0805-51)
R45  Resistance: 15 k  [CR0805]  (hidden comment: CR0805-51)
R46  Resistance: 15 k  [CR0805]  (hidden comment: CR0805-51)
R47  Resistance: 15 k  [CR0805]  (hidden comment: CR0805-51)
R48  Resistance: 15 k  [CR0805]  (hidden comment: CR0805-51)
R49  Resistance: 3.3 k  [CR0805]  (hidden comment: CR0805-51)
R50  Resistance: 1 k  [CR0805]  (hidden comment: CR0805-51)
U6  TLC7524CD  [SO16W]
X4  PLS-4  [61300411121]
X5  PLS-4  [61300411121]

### Sub-sheets
U_Tape = Tape.SchDoc: BEEP (in), TAPE_BIT (out), ~{BEEP} (out), TAPE_OUT_BIT (in), TAPE_IN (in)

### Ports
AC97_CLK (in), ADCDAT (out), AY_BC1 (in), AY_BDIR (in), AY_CLK (in), BCLK (in), BEEP (in), D[0..7], DACDAT (in), DACLRC (in), I2C (harness I2C), TAPE_BIT (out), TAPE_OUT_BIT (in), WR_DAC (in), ~{RES} (in)

### Harnesses
I2C: SDA, SCL

### Nets
3V3: C37.1 C42.1 C48.1 C52.1 C57.1 D4.8(DCVDD) D4.10(DBVDD) L5.1 L6.1 L7.1
5V0: C58.1 L8.1
A5V0: C59.1 C60.1 D5.8(V+) D6.25(A8) D6.26(~{SEL}) D6.28(BC2) D6.40(VCC) J6.2 J6.26 J6.30 J6.32 L8.2 U6.1(OUT1) U6.14(VDD)
AGND: C40.1 C41.1 C46.2 C47.2 C52.2 C53.2 C54.2 C58.2 C59.2 C60.2 D4.28(AGND) D4.33(EPAD) D5.4(V-) D6.1(GND) D6.24(~{A9}) J5.1 J6.1 J6.34 NT1.2 NT2.1 P2.2 R33.1 R34.1 R36.1 R47.2 R48.2 R50.1 U6.2(OUT2) U6.3(GND) U6.12(~{CS})
AVDD: C53.1 C54.1 D4.32(AVD) L7.2 R32.2
GND: C48.2 C57.2 D4.9(DGND) NT1.1 X4.2 X4.3 X5.2 X5.3
SPKGND: C37.2 C38.2 C39.2 C42.2 C43.2 C44.2 D4.20(SPKGND2) D4.24(SPKGND1) NT2.2
ADCDAT: D4.16(ADCDAT) ; port ADCDAT
AY_BC1: D6.29(BC1) J6.24 ; port AY_BC1
AY_BDIR: D6.27(BDIR) J6.28 ; port AY_BDIR
AY_CLK: D6.22(CLK) J6.38 ; port AY_CLK
~{BEEP}: R49.2 ; port BEEP  [project net BEEP]
BCLK: D4.12(BCLK) ; port BCLK
BEEP: sheet U_Tape/BEEP
CHA: D6.4(A) J6.5 R39.2  [project net CHA_3]
CHB: D6.3(B) J6.3 R40.2 R42.2  [project net CHB_3]
CHC: D6.38(C) J6.6 R44.2  [project net CHC_3]
D0: D6.37(DA0) J6.8 U6.11(DB0_(LSB))
D1: D6.36(DA1) J6.10 U6.10(DB1)
D2: D6.35(DA2) J6.12 U6.9(DB2)
D3: D6.34(DA3) J6.14 U6.8(DB3)
D4: D6.33(DA4) J6.16 U6.7(DB4)
D5: D6.32(DA5) J6.18 U6.6(DB5)
D6: D6.31(DA6) J6.20 U6.5(DB6)
D7: D6.30(DA7) J6.22 U6.4(DB7_(MSB))
DACDAT: D4.14(DACDAT) ; port DACDAT
DACLRC: D4.13(DACLRC) ; port DACLRC
JDET: D4.15(ADCLRC/GPIO1) J5.4 R32.1  [project net JDET_3]
left_ch1: C45.1 C62.2 R38.2 R46.1 R48.1  [project net left_ch1_3]
left_ch2: C50.2 D4.3(LINPUT2)  [project net left_ch2_3]
left_ch3: C55.2 D4.2(LINPUT3/JD2)  [project net left_ch3_3]
LOUT: C35.1 D4.31(HP_L)  [project net LOUT_3]
LOUT_PH: C35.2 C40.2 J5.2 P2.9 R33.2  [project net LOUT_PH_3]
MCLK: D4.11(MCLK) ; port AC97_CLK  [project net AC97_CLK]
~{RES}: D6.23(~{RS}) J6.36 ; port ~{RES}
right_ch1: C49.1 C63.2 R37.2 R45.1 R47.1  [project net right_ch1_3]
right_ch2: C51.2 D4.6(RINPUT2)  [project net right_ch2_3]
right_ch3: C56.2 D4.7(RINPUT3/JD3)  [project net right_ch3_3]
ROUT: C36.1 D4.29(HP_R)  [project net ROUT_3]
ROUT_PH: C36.2 C41.2 J5.3 P2.5 R34.2  [project net ROUT_PH_3]
SCL: D4.17(SCLK) ; port I2C.SCL  [project net I2C.SCL]
SDA: D4.18(SDIN) ; port I2C.SDA  [project net I2C.SDA]
SPK_LN: D4.23(SPK_LN) P1.2  [project net SPK_LN_3]
SPK_LP: D4.25(SPK_LP) P1.1  [project net SPK_LP_3]
SPK_RN: D4.19(SPK_RN) P1.4  [project net SPK_RN_3]
SPK_RP: D4.22(SPK_RP) P1.3  [project net SPK_RP_3]
TAPE_BIT: port TAPE_BIT, sheet U_Tape/TAPE_BIT
TAPE_IN: P2.1 ; sheet U_Tape/TAPE_IN
TAPE_OUT_BIT: port TAPE_OUT_BIT, sheet U_Tape/TAPE_OUT_BIT
WR_DAC: U6.13(~{WR}) ; port WR_DAC  [project net WRDAC]
NetC38_1: C38.1 C39.1 D4.26(SPKVDD1) L5.2
NetC43_1: C43.1 C44.1 D4.21(SPKVDD2) L6.2
NetC45_2: C45.2 D4.4(LINPUT1)
NetC46_1: C46.1 C47.1 D4.27(VMID)
NetC49_2: C49.2 D4.5(RINPUT1)
NetC50_1: C50.1 X4.1
NetC51_1: C51.1 X4.4
NetC55_1: C55.1 X5.1
NetC56_1: C56.1 X5.4
NetC61_1: C61.1 R37.1 R38.1
NetC61_2: C61.2 D5.6(IN2-) D5.7(2OUT)
NetC62_1: C62.1 R39.1 R41.1
NetC63_1: C63.1 R43.1 R44.1
NetC64_1: C64.1 R49.1 R50.2
NetC64_2: C64.2 R45.2 R46.2
NetD5_1: D5.1(1OUT) D5.2(IN1-) R35.2
NetD5_3: D5.3(IN1+) U6.15(REF)
NetD5_5: D5.5(IN2+) R35.1 R36.2
NetR40_1: R40.1 R41.2
NetR42_1: R42.1 R43.2

Not connected (* = marked no-connect by the designer): D4 1(MICBIAS) 30(OUT3); D6 2(n.c.) 5(n.c.) 6(IOB7) 7(IOB6) 8(IOB5) 9(IOB4) 10(IOB3) 11(IOB2) 12(IOB1) 13(IOB0) 14(IOA7) 15(IOA6) 16(IOA5) 17(IOA4) 18(IOA3) 19(IOA2) 20(IOA1) 21(IOA0) 39(TST1); J5 5; J6 4 7 9 11 13 15 17 19 21 23 25 27 29 31 33 35 37 39 40; P2 3 4 6 7 8 10; U6 16(RFB)

### Buses and harness runs
bus D[0..7] = port D[0..7]

### Notes on the sheet
- (in symbol LM358DR, part A) -
- (in symbol LM358DR, part B) -
- (in symbol YM2149) SSG

### Library data of the parts
C35 C36 = CMP-1662-00011-2: Chip Capacitor, 100 uF, +/- 20%, 6.3 V, -55 to 85 degC, 1206 (3216 Metric), RoHS, Tape and Reel; PartNumber: GRM31CR60J107ME39L; Manufacturer: Murata; value: 100 uF; PackageDescription: 2-Pin Surface Mount Device, Body 3.2 x 1.6 mm; Manufacturer Part Number: GRM31CR60J107ME39L; Case/Package: 1206; Category: Cap
C37-C44 C46-C48 C52-C54 C57-C60 = CC0805: as C81-C88 on sheet USB; Category: Cap; value: 1.5pF; Case/Package: 0805
C45 C49-C51 C55 C56 C61-C64 = CC0805: as C102 on sheet ESP32; Case/Package: 0805; value: 1.5pF; Category: Cap
D4 = WM8960CGEFL/RV: Stereo CODEC with 1W Stereo Class-D speaker Drivers; value: WM8960CGEFL/RV; Case/Package: QNF-32; Category: IC
D5 = LM358DR: IC OPAMP GP 2 CIRCUIT 8SOIC; Manufacturer: Texas Instruments; Case/Package: SOIC; Number of Pins: 8; Manufacturer Part Number: LM358DR; value: LM358DR; Category: IC
J5 = SJ1-3535NG-PI: 3.5 mm Right-Angle Stereo Jack, 5 pin PCB PCB Mount, Isolated Ground, Pink; MF: {'manufacturer': u'CUI'}; Value: *; MP: SJ1-3535NG-PI; Availability: Unavailable; Price: None; Package: None
J6 = CMP-1502-01135-1: THT Vertical Pin Header WR-PHD, Pitch 2.54 mm, Dual Row, 40 pins; Manufacturer: Wurth Elektronik; Contact Resistance: 20mOhm; Pitch: 2.54mm; Pin Number: 40; Withstanding Voltage: 500VAC; Gender: Male; Rated Current: 3A; Working Voltage: 250VAC; Operating Temperature: -40to105degC; Manufacturer URL: http://www.we-online.de; Orientation: Vertical; Datasheet URL: https://katalog.we-online.de/em/datasheet/6130xx21121.pdf; Package Reference: 61304021121; Row Number: Dual; Part Number: 61304021121; Packaging: Bag; Mounting Technology: THT; Publisher: WurthElektronik
L5-L7 = CMP-14484-001222-1: SMD Power Inductors 47uH ±20% 0.92A 0.39Ω; Current Rating: 920mA; Test Frequency: 100kHz; Core Material: Ferrite; Self Resonant Frequency: 8MHz; Shielding: Shielded; DC Resistance (DCR): 390mR; Saturation Current: 950mA; Termination: SMD/SMT; Package Quantity: 2000; RoHS Compliant: Yes; Halogen Free: Halogen Free; Length: 0.236inch; Series: NR; Tolerance: 20%; Width: 0.236inch; Height - Seated (Max): 0.11inch; Number of Pins: 2; Mount: Surface Mount; Min Operating Temperature: -25°C; RMS Current (Irms): 920mA; Packaging: Tape and Reel; Resistor Type: Wirewound; Case/Package: 2424; Inductance Tolerance: 20%; Max Operating Temperature: 120°C; Max DC Current: 920mA; Height: 2.8mm
L8 = CMP-06042-007646-1: Wire Wound Ferrite Inductor for Power Lines 22μH ±10% 0.6Ω 420mA 1812; Manufacturer: Murata; Frequency: 15MHz; Shielding: Unshielded; Test Frequency: 1MHz; DC Resistance (DCR): 600mR; Mount: Surface Mount; Width: 3.2mm; Depth: 3.4mm; Packaging: Tape and Reel; Case Code (Imperial): 1812; DC Current: 420mA; Weight: 0.004586oz; Core Material: Ferrite; Height: 2.6mm; Number of Pins: 2; Min Operating Temperature: -40°C; Max Operating Temperature: 85°C; REACH SVHC: No SVHC; Self Resonant Frequency: 15MHz; Termination: SMD/SMT; Lead Free: Lead Free; Military Standard: Not; Case Code (Metric): 4532; Length: 4.5mm; Radiation Hardening: No; Inductance Tolerance: 10%; Tolerance: 10%; Height - Seated (Max): 0.11inch; Case/Package: 1812; Max DC Current: 420mA; Package Quantity: 500; Resistor Type: Wirewound; Current Rating: 420mA; Manufacturer Part Number: LQH43CN220K03L
P1 X4 X5 = PLS-4: THT Vertical Pin Header WR-PHD, Pitch 2.54 mm, Single Row, 4 pins; Manufacturer: Wurth Electronics; Pitch: 2.54mm; value: header 4 pin 2.54mm; Manufacturer Part Number: 61300411121; Case/Package: PLS-4; Category: Connector
P2 = CMP-1502-01084-1: THT Vertical Pin Header WR-PHD, Pitch 2.54 mm, Dual Row, 10 pins; Manufacturer: Wurth Elektronik; Working Voltage: 250VAC; Pitch: 2.54mm; Contact Resistance: 20mOhm; Gender: Male; Rated Current: 3A; Withstanding Voltage: 500VAC; Pin Number: 10; Operating Temperature: -40to105degC; Mounting Technology: THT; Publisher: WurthElektronik; Manufacturer URL: http://www.we-online.de; Part Number: 61301021121; Row Number: Dual; Packaging: Bag; Orientation: Vertical; Package Reference: 61301021121; Datasheet URL: https://katalog.we-online.de/em/datasheet/6130xx21121.pdf
R32-R34 R50 = CR0805: as R96 on sheet USB; Number of Terminations: 2; Case/Package: 0805; value: 51Ω; Category: Res; Termination: SMD/SMT; Number of Pins: 2
R35-R49 = CR0805: as R68 on sheet USB; Category: Res; value: 51Ω; Case/Package: 0805; Number of Terminations: 2; Termination: SMD/SMT; Number of Pins: 2
U6 = TLC7524CD: 8-Bit, 0.1 us MDAC, Parallel Input, Fast Control Signalling for DSP, Easy Micro Interface, 0 to 70 degC, 16-pin SOIC (D16), Green (RoHS & no Sb/Br); Manufacturer: Texas Instruments; PackageDescription: 16-Pin Plastic Small Outline, Body 9.9 x 3.9 mm, Pitch 1.27 mm; PartNumber: TLC7524CD; Manufacturer Part Number: TLC7524CD; value: TLC7524CD; Case/Package: SOIC-16; Category: IC
D6 = YM2149: Value: YM2149; Case/Package: DIP-40; Category: IC

## Sheet Tape.SchDoc
size A4; SheetNumber: 4; SheetTotal: 15
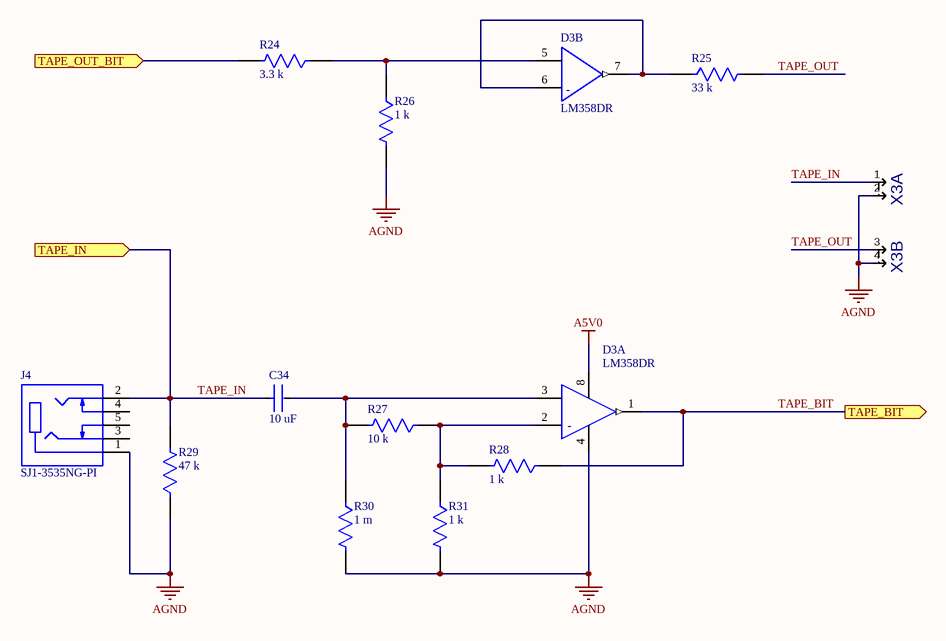
[diagram p13: Tape.SchDoc]

### Parts
C34  Capacitance: 10 uF  [CC0805]  (hidden comment: CC0805-1.5pF)
D3  LM358DR  [FP-D0008A-MFG]  (parts A,B of 2)
J4  SJ1-3535NG-PI  [CUI_SJ1-3535NG-PI]
R24  Resistance: 3.3 k  [CR0805]  (hidden comment: CR0805-51)
R25  Resistance: 33 k  [CR0805]  (hidden comment: CR0805-51)
R26  Resistance: 1 k  [CR0805]  (hidden comment: CR0805-51)
R27  Resistance: 10 k  [CR0805]  (hidden comment: CR0805-51)
R28  Resistance: 1 k  [CR0805]  (hidden comment: CR0805-51)
R29  Resistance: 47 k  [CR0805]  (hidden comment: CR0805-51)
R30  Resistance: 1 m  [CR0805]  (hidden comment: CR0805-51)
R31  Resistance: 1 k  [CR0805]  (hidden comment: CR0805-51)
X3  PLB2-2  [PLB2-2]  (value not drawn)  (parts A,B of 2)

### Ports
TAPE_BIT (out), TAPE_IN (in), TAPE_OUT_BIT (in)

### Nets
A5V0: D3.8(V+)
AGND: D3.4(V-) J4.1 R26.2 R29.1 R30.2 R31.2 X3.2 X3.4
TAPE_BIT: D3.1(1OUT) R28.1 ; port TAPE_BIT
TAPE_IN: C34.1 J4.2 R29.2 X3.1 ; port TAPE_IN
TAPE_OUT: R25.2 X3.3  [project net TAPE_OUT_4]
TAPE_OUT_BIT: R24.2 ; port TAPE_OUT_BIT
NetC34_2: C34.2 D3.3(IN1+) R27.2 R30.1
NetD3_2: D3.2(IN1-) R27.1 R28.2 R31.1
NetD3_5: D3.5(IN2+) R24.1 R26.1
NetD3_6: D3.6(IN2-) D3.7(2OUT) R25.1

Not connected (* = marked no-connect by the designer): J4 3 4 5

### Notes on the sheet
- (in symbol LM358DR, part A) -
- (in symbol LM358DR, part B) -

### Library data of the parts
C34 = CC0805: as C81-C88 on sheet USB; value: 1.5pF; Category: Cap; Case/Package: 0805
D3 = LM358DR: as D5 on sheet AY Amp; Case/Package: SOIC; Number of Pins: 8; Manufacturer Part Number: LM358DR; value: LM358DR; Category: IC
J4 = SJ1-3535NG-PI: as J5 on sheet AY Amp; Value: *; MP: SJ1-3535NG-PI; Availability: Unavailable; Price: None; Package: None
R24 = CR0805: as R68 on sheet USB; value: 51Ω; Category: Res; Case/Package: 0805; Number of Terminations: 2; Termination: SMD/SMT; Number of Pins: 2
R25-R31 = CR0805: as R96 on sheet USB; Number of Terminations: 2; Case/Package: 0805; value: 51Ω; Category: Res; Termination: SMD/SMT; Number of Pins: 2
X3 = PLB2-2: Value: PLD-4; Case/Package: PLD-4; Category: Connector

## Sheet PLL.SchDoc
size A4; SheetNumber: 15; SheetTotal: 15
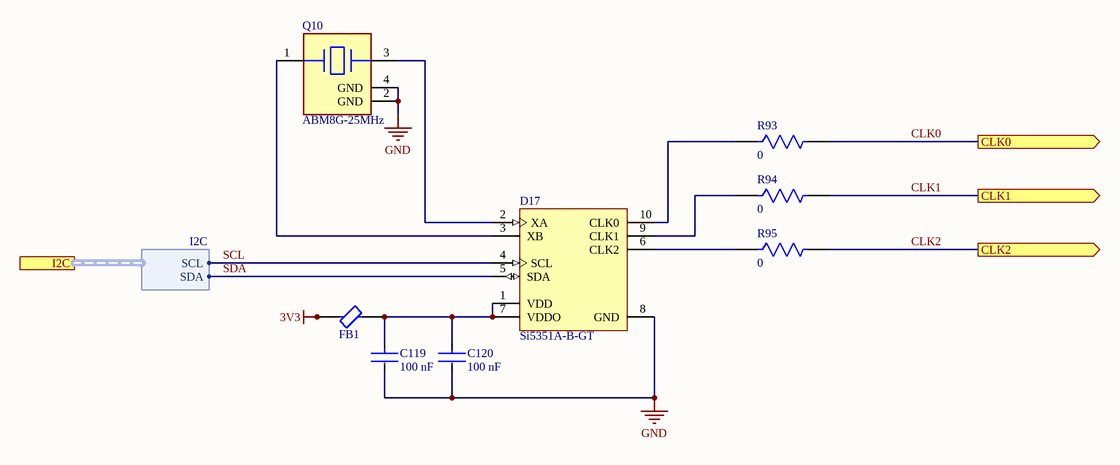
[diagram p14: PLL.SchDoc]

### Parts
C119  Capacitance: 100 nF  [CC0805]  (hidden comment: CC0805-1.5pF)
C120  Capacitance: 100 nF  [CC0805]  (hidden comment: CC0805-1.5pF)
D17  Si5351A-B-GT  [SLAB-MSOP-10_L]
FB1  BLM21AG601SN1J  [FP-BLM21-0_2-t0_85-e0_5-IPC_A]  (value not drawn)
Q10  ABM8G-25MHz  [FP-ABM8G-MFG]
R93  Resistance: 0  [CR0805]  (hidden comment: CR0805-51)
R94  Resistance: 0  [CR0805]  (hidden comment: CR0805-51)
R95  Resistance: 0  [CR0805]  (hidden comment: CR0805-51)

### Ports
CLK0 (out), CLK1 (out), CLK2 (out), I2C (harness I2C)

### Harnesses
I2C: SDA, SCL

### Nets
3V3: FB1.1
GND: C119.2 C120.2 D17.8(GND) Q10.2(GND) Q10.4(GND)
CLK0: R93.2 ; port CLK0  [project net FPGA_CLK]
CLK1: R94.2 ; port CLK1  [project net AC97_CLK]
CLK2: R95.2 ; port CLK2  [project net AY_CLK]
SCL: D17.4(SCL) ; port I2C.SCL  [project net I2C.SCL]
SDA: D17.5(SDA) ; port I2C.SDA  [project net I2C.SDA]
NetC119_1: C119.1 C120.1 D17.1(VDD) D17.7(VDDO) FB1.2
NetD17_2: D17.2(XA) Q10.3
NetD17_3: D17.3(XB) Q10.1
NetD17_6: D17.6(CLK2) R95.1
NetD17_9: D17.9(CLK1) R94.1
NetD17_10: D17.10(CLK0) R93.1

### Library data of the parts
C119 C120 = CC0805: as C81-C88 on sheet USB; Category: Cap; value: 1.5pF; Case/Package: 0805
D17 = Si5351A-B-GT: I2C-Programmable Any-Frequency CMOS Clock Generator + VCXO, 2.5 / 3.3 V, 0.008 to 160 MHz Output, -40 to 85 degC, 10-pin SOP; Manufacturer: Silicon Labs; PackageDescription: 10-Pin Mini Small Outline Package, Body 3 x 3 mm, Pitch 0.5 mm; PartNumber: Si5351A-B-GT; Manufacturer Part Number: SI5351A-B-GT; value: SI5351A-B-GT; Case/Package: MSOP-10; Category: IC
FB1 = BLM21AG601SN1J: Chip Ferrite Bead, 0805, 600Ω @ 100MHz, 0.2Ω, 25%, 700mA; Manufacturer: Murata; Number of Pins: 2; Case/Package: 0805; Termination: Flat; Manufacturer Part Number: BLM21AG601SN1J; value: BLM21AG601SN1J; Category: Inductor
Q10 = ABM8G-25MHz: CRYSTAL 25.0000MHZ 10PF SMD; Manufacturer: Abracon; Manufacturer Part Number: ABM8G-25.000MHZ-B4Y-T; value: ABM8G-25.000MHZ-B4Y-T; Termination: SMD/SMT; Case/Package: SMD/SMT; Number of Pins: 4; Category: CrystalsandOscillators
R93-R95 = CR0805: as R96 on sheet USB; Case/Package: 0805; Number of Pins: 2; Termination: SMD/SMT; value: 51Ω; Category: Res; Number of Terminations: 2

## Sheet Gamepads.SchDoc
size A4; SheetNumber: 10; SheetTotal: 15
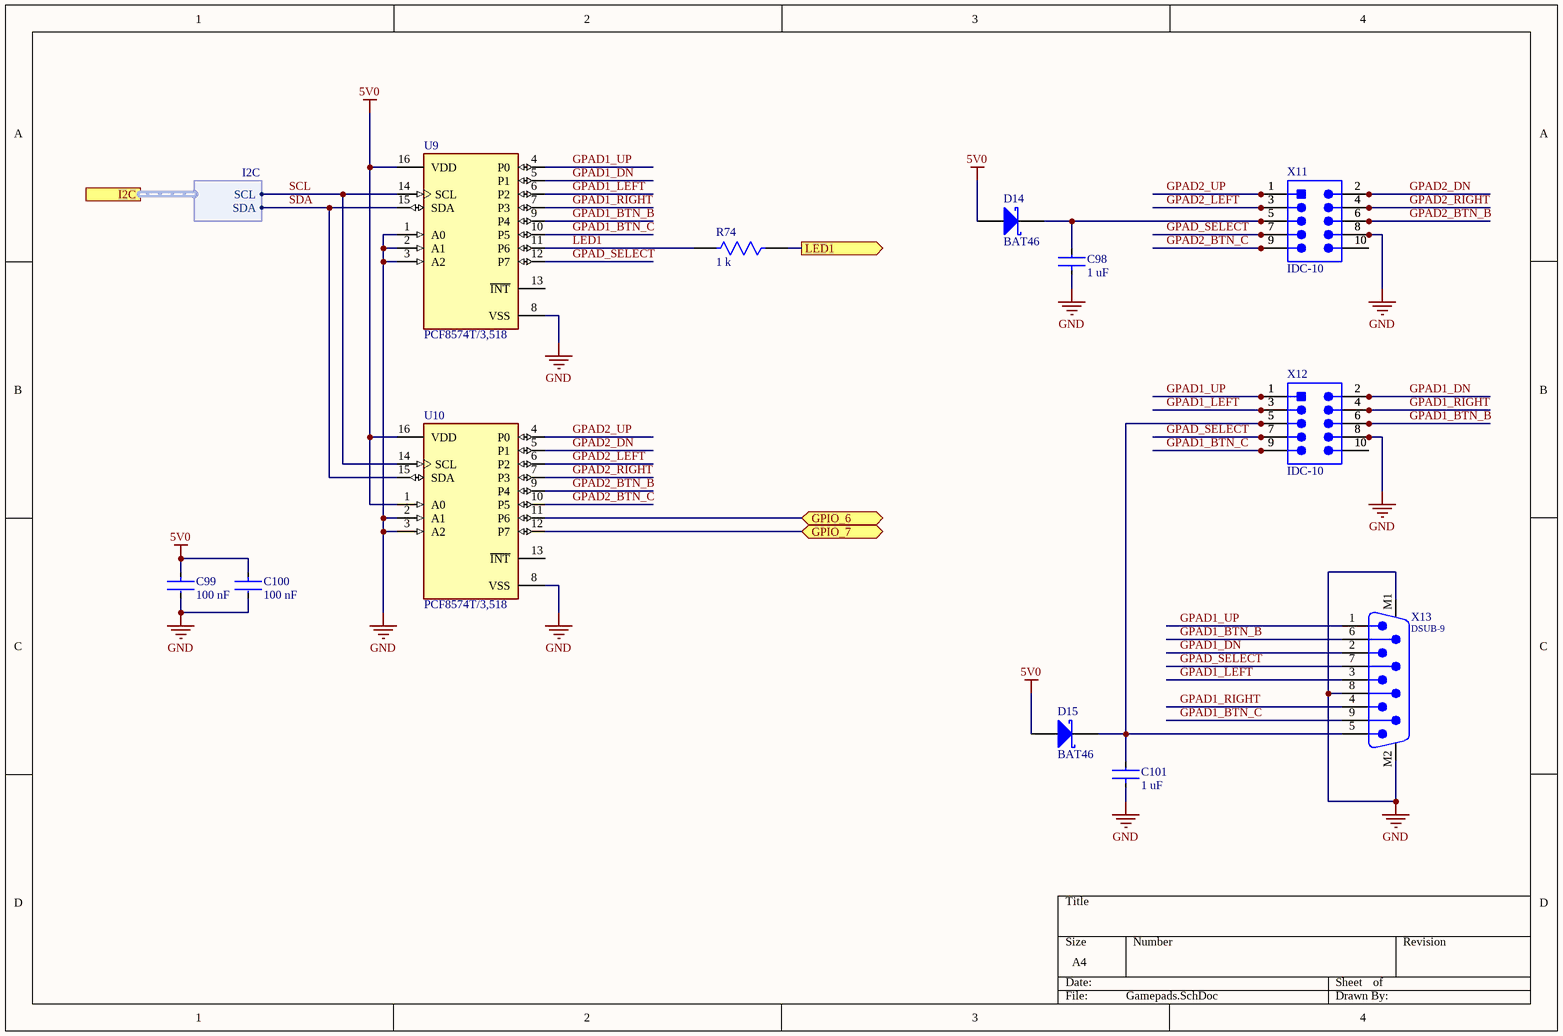
[diagram p15: Gamepads.SchDoc]

### Parts
C98  Capacitance: 1 uF  [CC0805]  (hidden comment: CC0805-1.5pF)
C99  Capacitance: 100 nF  [CC0805]  (hidden comment: CC0805-1.5pF)
C100  Capacitance: 100 nF  [CC0805]  (hidden comment: CC0805-1.5pF)
C101  Capacitance: 1 uF  [CC0805]  (hidden comment: CC0805-1.5pF)
D14  BAT46  [STM-DO-35-2]
D15  BAT46  [STM-DO-35-2]
R74  Resistance: 1 k  [CR0805]  (hidden comment: CR0805-51)
U9  PCF8574T/3,518  [FP-SOT162-1-MFG]
U10  PCF8574T/3,518  [FP-SOT162-1-MFG]
X11  IDC-10  [BH-10]
X12  IDC-10  [BH-10]
X13  DSUB-9  [618009231221]

### Ports
GPIO_6 (bidir), GPIO_7 (bidir), I2C (harness I2C), LED1 (out)

### Harnesses
I2C: SDA, SCL

### Nets
5V0: C99.1 C100.1 D14.1(A) D15.1(A) U9.16(VDD) U10.1(A0) U10.16(VDD)
GND: C98.1 C99.2 C100.2 C101.1 U9.1(A0) U9.2(A1) U9.3(A2) U9.8(VSS) U10.2(A1) U10.3(A2) U10.8(VSS) X11.8 X12.8 X13.8 X13.M1 X13.M2
ESP_LED: R74.1 ; port LED1
GPAD1_BTN_B: U9.9(P4) X12.6 X13.6  [project net GPAD1_BTN_B_10]
GPAD1_BTN_C: U9.10(P5) X12.9 X13.9  [project net GPAD1_BTN_C_10]
GPAD1_DN: U9.5(P1) X12.2 X13.2  [project net GPAD1_DN_10]
GPAD1_LEFT: U9.6(P2) X12.3 X13.3  [project net GPAD1_LEFT_10]
GPAD1_RIGHT: U9.7(P3) X12.4 X13.4  [project net GPAD1_RIGHT_10]
GPAD1_UP: U9.4(P0) X12.1 X13.1  [project net GPAD1_UP_10]
GPAD2_BTN_B: U10.9(P4) X11.6  [project net GPAD2_BTN_B_10]
GPAD2_BTN_C: U10.10(P5) X11.9  [project net GPAD2_BTN_C_10]
GPAD2_DN: U10.5(P1) X11.2  [project net GPAD2_DN_10]
GPAD2_LEFT: U10.6(P2) X11.3  [project net GPAD2_LEFT_10]
GPAD2_RIGHT: U10.7(P3) X11.4  [project net GPAD2_RIGHT_10]
GPAD2_UP: U10.4(P0) X11.1  [project net GPAD2_UP_10]
GPAD_SELECT: U9.12(P7) X11.7 X12.7 X13.7  [project net GPAD_SELECT_10]
LED1: R74.2 U9.11(P6)  [project net LED1_10]
SCL: U9.14(SCL) U10.14(SCL) ; port I2C.SCL  [project net I2C.SCL]
SDA: U9.15(SDA) U10.15(SDA) ; port I2C.SDA  [project net I2C.SDA]
NetC98_2: C98.2 D14.2(K) X11.5
NetC101_2: C101.2 D15.2(K) X12.5 X13.5
NetU10_11: U10.11(P6) ; port GPIO_6
NetU10_12: U10.12(P7) ; port GPIO_7

Not connected (* = marked no-connect by the designer): U9 13(~{INT}); U10 13(~{INT}); X11 10; X12 10

### Library data of the parts
C98 C101 = CC0805: as C102 on sheet ESP32; Case/Package: 0805; value: 1.5pF; Category: Cap
C99 C100 = CC0805: as C81-C88 on sheet USB; Category: Cap; value: 1.5pF; Case/Package: 0805
D14 D15 = BAT46: Small Signal Schottky Diode, 150 mA, 100 V, -65 to 125 degC, 2-Pin DO-35, RoHS, Tape and Reel; Manufacturer: STMicroelectronics; Manufacturer Part Number: BAT46; value: BAT46; Category: Diode
R74 = CR0805: as R96 on sheet USB; Case/Package: 0805; Number of Terminations: 2; value: 51Ω; Category: Res; Termination: SMD/SMT; Number of Pins: 2
U9 U10 = PCF8574T/3,518: IC I/O EXPANDER I2C 8B 16SOIC; Manufacturer: NXP Semiconductors; Manufacturer Part Number: PCF8574T/3,518; Category: IC; value: PCF8574T/3,518; Case/Package: SOT162-1
X11 X12 = IDC-10: as X16 on sheet ESP32; Case/Package: IDC-10; Category: Connector
X13 = DSUB-9_1: Male PCB Connector with Hex Screw WR-DSUB, 8.08 mm, Angled, 9 pins; Manufacturer: Wurth Electronics; value: DSUB, Angled, 9 pins; Manufacturer Part Number: 618009231221; Case/Package: DSUB-9; Category: Connector